# Altium project GN-1846-E-V2_HI3531A.PRJPCB (part 1 of 5)
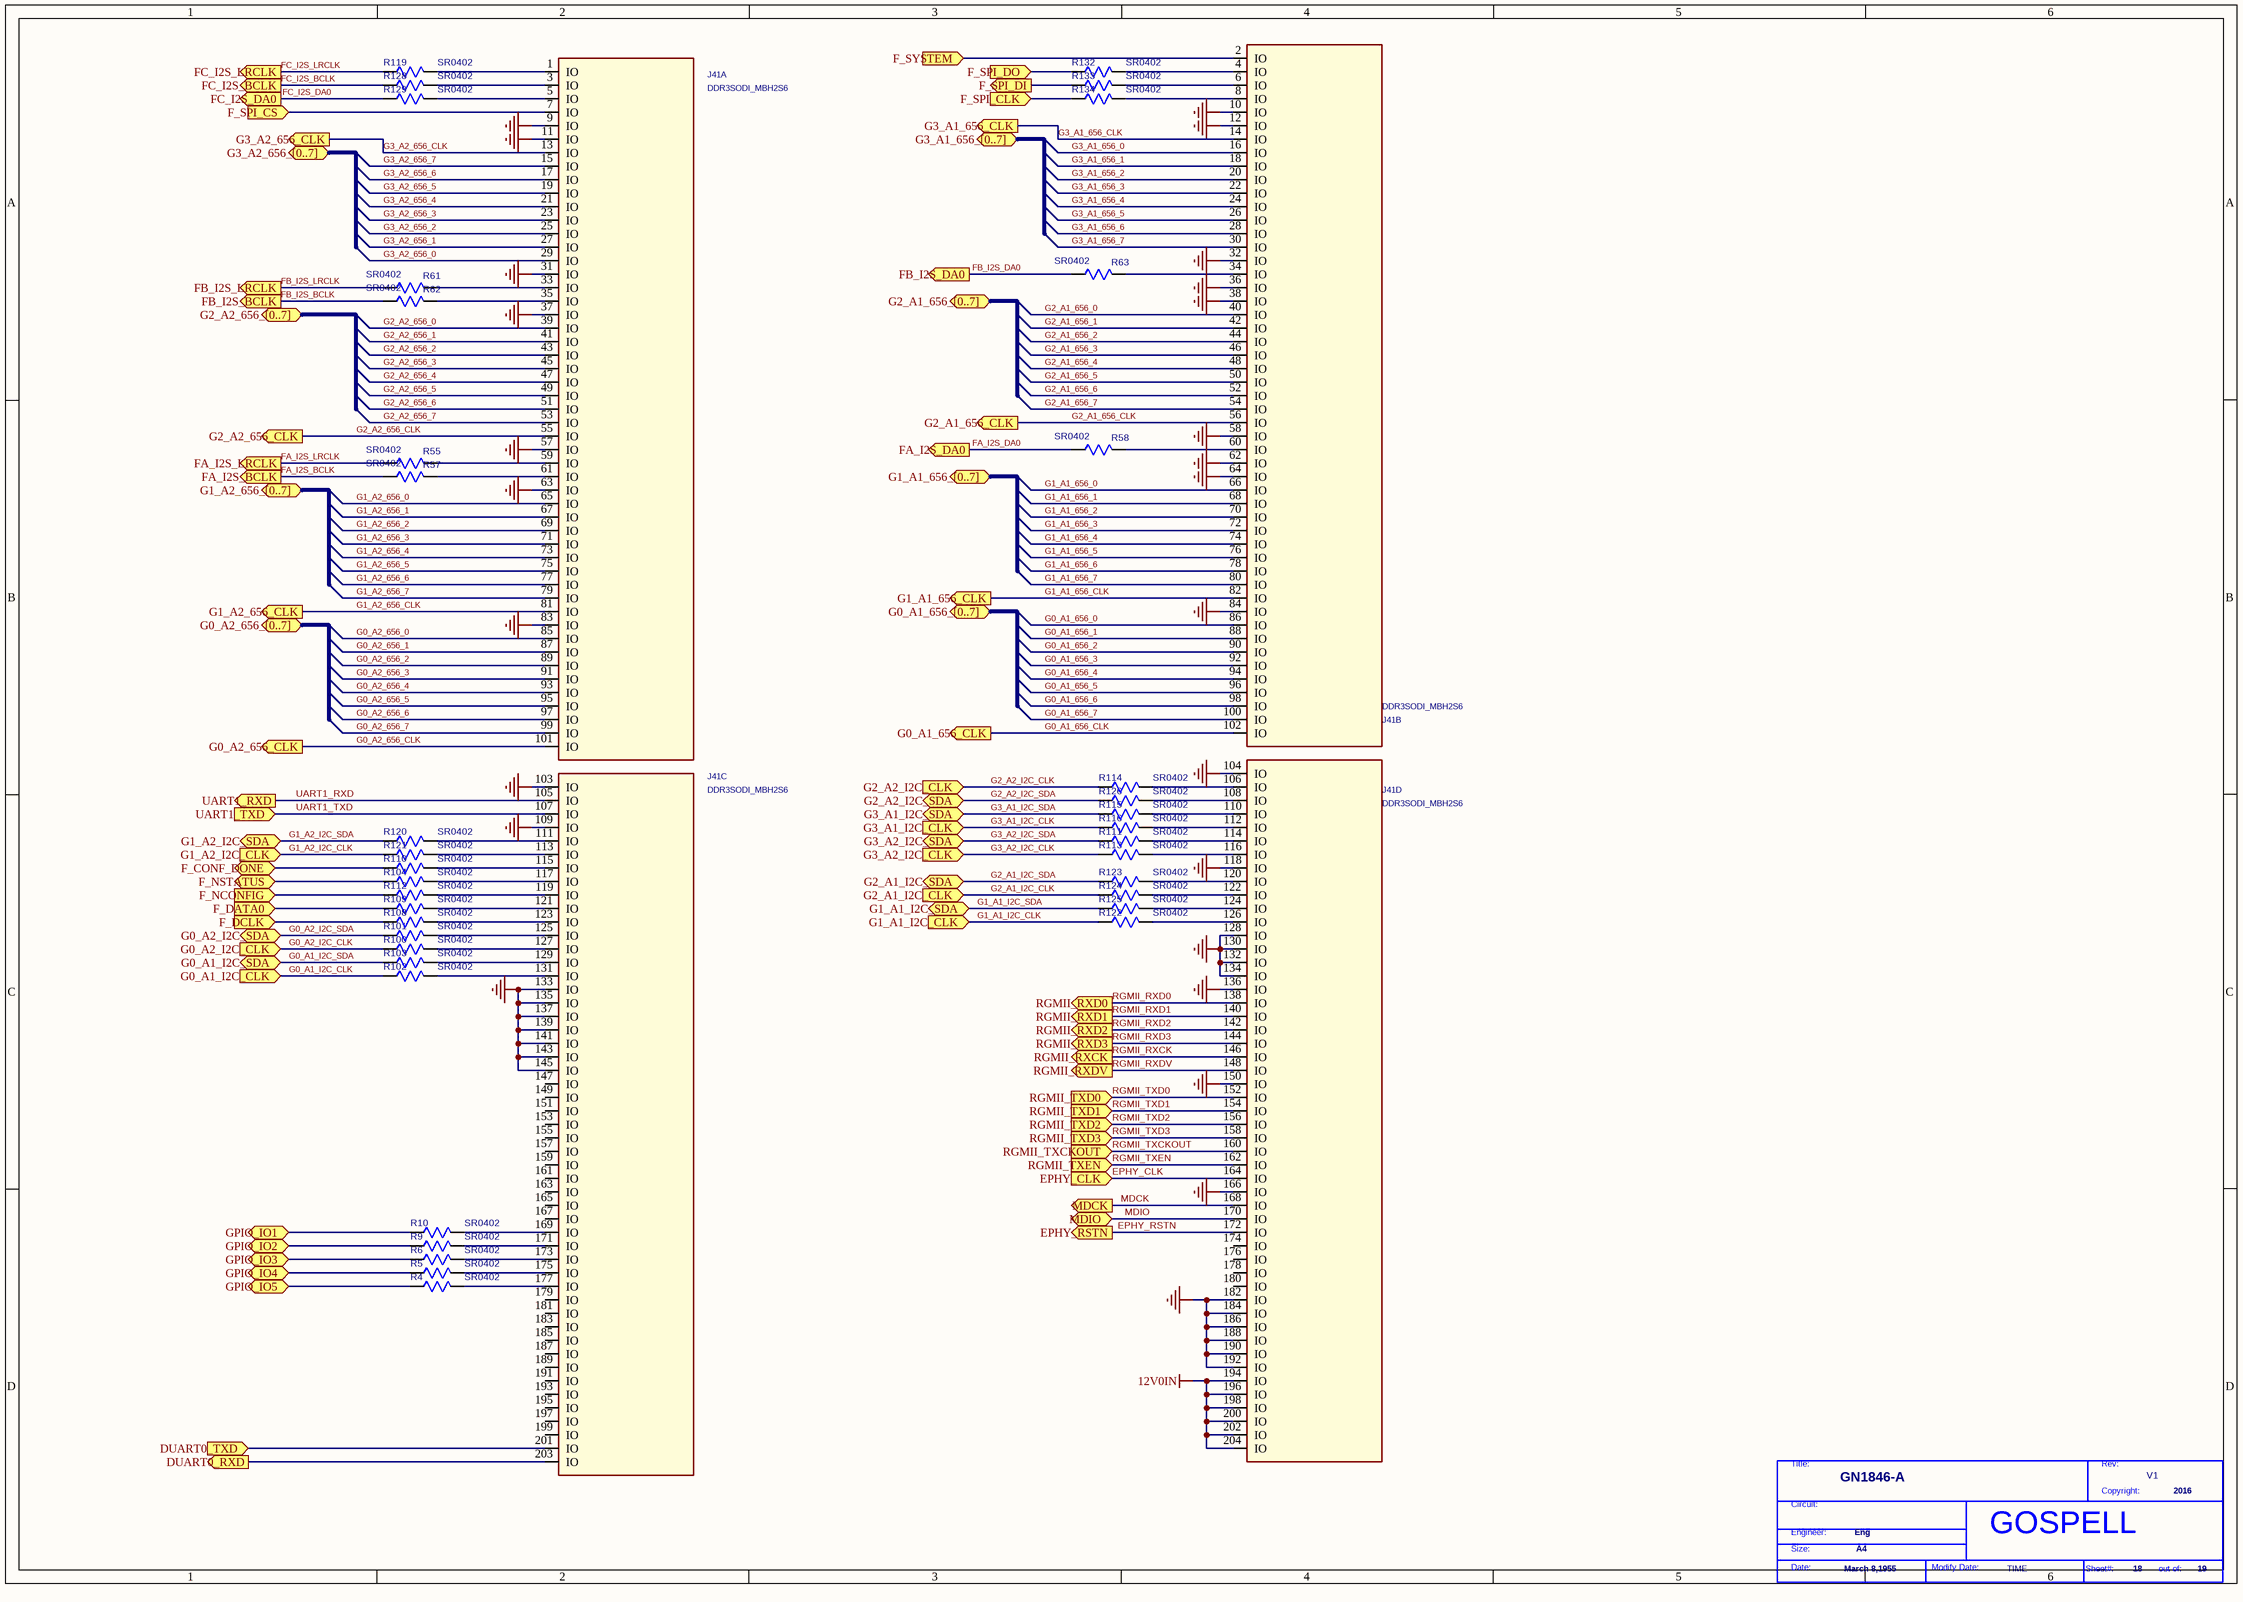
[diagram p0: P18 CONNECT DDR1.SchDoc]
18 sheets, 474 parts. Net scope: flat (ports and power ports of the same name join across sheets).
Board file: GN-1846-E-V2.PcbDoc
Sheets:
  P18 CONNECT DDR1.SchDoc
  P17 Hi3531AV100 (AD).SchDoc
  P16 Hi3531AV100(RGMII&I.SchDoc
  P15 Hi3531AV100(VO&I2S3.SchDoc
  P14 Hi3531AV100(SATA&PC.SchDoc
  P13 Configuration.SchDoc
  P12 SPI&NAND FLASH.SchDoc
  P11 Hi3531A(SYSTEM)&RES.SchDoc
  P10 DDRC&D NOVTT.SchDoc
  P09 DDRA&B NOVTT.SchDoc
  P08 Hi3531AV100(DDRC0 D.SchDoc
  P07 Hi3531AV100(POWER).SchDoc
  P06 Hi3531AV100(GND).SchDoc
  P05 Power Supply2.SchDoc
  P04 Power Supply1.SchDoc
  P03 POWER TREE.SchDoc
  P02 BLOCK DIAGRAM.SchDoc
  P01 NOTE $ TITLE.SchDoc

## Sheet P18 CONNECT DDR1.SchDoc
size 420 x 297 mm

### Parts
(Parts that share a designator on the sheet are numbered #1, #2 ... from top to bottom, then left to right.)
*#1  Page Modify Date: TIME  Engineer: Eng  Copyright: 2016  Title: GN1846-A  RevCode: V1  Page Size: A4  Page Create Date: March 8,1955  Page Number: 18  Page Count: 19  (hidden comment: GOSPELL)  (graphical)
J41  DDR3SODI_MBH2S6  [DDR3SODI_MBH2S6]  (parts A,B,C,D of 4)
R4  SR0402  [SR0402]
R5  SR0402  [SR0402]
R6  SR0402  [SR0402]
R9  SR0402  [SR0402]
R10  SR0402  [SR0402]
R55  SR0402  [SR0402]
R57  SR0402  [SR0402]
R58  SR0402  [SR0402]
R61  SR0402  [SR0402]
R62  SR0402  [SR0402]
R63  SR0402  [SR0402]
R100  SR0402  [SR0402]
R101  SR0402  [SR0402]
R102  SR0402  [SR0402]
R103  SR0402  [SR0402]
R104  SR0402  [SR0402]
R108  SR0402  [SR0402]
R109  SR0402  [SR0402]
R110  SR0402  [SR0402]
R111  SR0402  [SR0402]
R112  SR0402  [SR0402]
R113  SR0402  [SR0402]
R114  SR0402  [SR0402]
R115  SR0402  [SR0402]
R116  SR0402  [SR0402]
R119  SR0402  [SR0402]
R120  SR0402  [SR0402]
R121  SR0402  [SR0402]
R122  SR0402  [SR0402]
R123  SR0402  [SR0402]
R124  SR0402  [SR0402]
R125  SR0402  [SR0402]
R126  SR0402  [SR0402]
R128  SR0402  [SR0402]
R129  SR0402  [SR0402]
R132  SR0402  [SR0402]
R133  SR0402  [SR0402]
R134  SR0402  [SR0402]

### Ports
DUART0_RXD (out), DUART0_TXD (in), EPHY_CLK (in), EPHY_RSTN (out), F_CONF_DONE (bidir), F_DATA0 (in), F_DCLK (in), F_NCONFIG (in), F_NSTATUS (bidir), F_SPI_CLK (in), F_SPI_CS (in), F_SPI_DI (out), F_SPI_DO (in), F_SYSTEM (in), FA_I2S_BCLK (out), FA_I2S_DA0 (out), FA_I2S_LRCLK (out), FB_I2S_BCLK (out), FB_I2S_DA0 (out), FB_I2S_LRCLK (out), FC_I2S_BCLK (out), FC_I2S_DA0 (out), FC_I2S_LRCLK (out), G0_A1_656_[0..7] (bidir), G0_A1_656_CLK (out), G0_A1_I2C_CLK (in), G0_A1_I2C_SDA (bidir), G0_A2_656_[0..7] (bidir), G0_A2_656_CLK (out), G0_A2_I2C_CLK (in), G0_A2_I2C_SDA (bidir), G1_A1_656_[0..7] (bidir), G1_A1_656_CLK (out), G1_A1_I2C_CLK (in), G1_A1_I2C_SDA (bidir), G1_A2_656_[0..7] (bidir), G1_A2_656_CLK (out), G1_A2_I2C_CLK (in), G1_A2_I2C_SDA (bidir), G2_A1_656_[0..7] (bidir), G2_A1_656_CLK (out), G2_A1_I2C_CLK (in), G2_A1_I2C_SDA (bidir), G2_A2_656_[0..7] (bidir), G2_A2_656_CLK (out), G2_A2_I2C_CLK (in), G2_A2_I2C_SDA (bidir), G3_A1_656_[0..7] (bidir), G3_A1_656_CLK (out), G3_A1_I2C_CLK (in), G3_A1_I2C_SDA (bidir), G3_A2_656_[0..7] (bidir), G3_A2_656_CLK (out), G3_A2_I2C_CLK (in), G3_A2_I2C_SDA (bidir), GPIO_IO1 (bidir), GPIO_IO2 (bidir), GPIO_IO3 (bidir), GPIO_IO4 (bidir), GPIO_IO5 (bidir), MDCK (out), MDIO (bidir), RGMII_RXCK (out), RGMII_RXD0 (out), RGMII_RXD1 (out), RGMII_RXD2 (out), RGMII_RXD3 (out), RGMII_RXDV (out), RGMII_TXCKOUT (in), RGMII_TXD0 (in), RGMII_TXD1 (in), RGMII_TXD2 (in), RGMII_TXD3 (in), RGMII_TXEN (in), UART1_RXD (out), UART1_TXD (in)

### Nets
12V0IN: J41.194(IO) J41.196(IO) J41.198(IO) J41.200(IO) J41.202(IO) J41.204(IO)
GND: J41.9(IO) J41.10(IO) J41.11(IO) J41.12(IO) J41.31(IO) J41.32(IO) J41.36(IO) J41.37(IO) J41.38(IO) J41.57(IO) J41.58(IO) J41.62(IO) J41.63(IO) J41.64(IO) J41.83(IO) J41.84(IO) J41.103(IO) J41.104(IO) J41.109(IO) J41.118(IO) J41.128(IO) J41.130(IO) J41.132(IO) J41.133(IO) J41.134(IO) J41.135(IO) J41.136(IO) J41.137(IO) J41.139(IO) J41.141(IO) J41.143(IO) J41.145(IO) J41.150(IO) J41.166(IO) J41.182(IO) J41.184(IO) J41.186(IO) J41.188(IO) J41.190(IO) J41.192(IO)
EPHY_CLK: J41.164(IO) ; port EPHY_CLK
EPHY_RSTN: J41.172(IO) ; port EPHY_RSTN
F_SPI_CLK: R134.1(A) ; port F_SPI_CLK
F_SPI_CS: J41.7(IO) ; port F_SPI_CS
F_SPI_DI: R133.1(A) ; port F_SPI_DI
F_SPI_DO: R132.1(A) ; port F_SPI_DO
FA_I2S_BCLK: R57.2(B) ; port FA_I2S_BCLK
FA_I2S_DA0: R58.2(B) ; port FA_I2S_DA0
FA_I2S_LRCLK: R55.2(B) ; port FA_I2S_LRCLK
FB_I2S_BCLK: R62.2(B) ; port FB_I2S_BCLK
FB_I2S_DA0: R63.2(B) ; port FB_I2S_DA0
FB_I2S_LRCLK: R61.2(B) ; port FB_I2S_LRCLK
FC_I2S_BCLK: R128.1(A) ; port FC_I2S_BCLK
FC_I2S_DA0: R129.1(A) ; port FC_I2S_DA0
FC_I2S_LRCLK: R119.1(A) ; port FC_I2S_LRCLK
G0_A1_656_0: J41.86(IO)
G0_A1_656_1: J41.88(IO)
G0_A1_656_2: J41.90(IO)
G0_A1_656_3: J41.92(IO)
G0_A1_656_4: J41.94(IO)
G0_A1_656_5: J41.96(IO)
G0_A1_656_6: J41.98(IO)
G0_A1_656_7: J41.100(IO)
G0_A1_656_CLK: J41.102(IO) ; port G0_A1_656_CLK
G0_A1_I2C_CLK: R102.1(A) ; port G0_A1_I2C_CLK
G0_A1_I2C_SDA: R103.1(A) ; port G0_A1_I2C_SDA
G0_A2_656_0: J41.85(IO)
G0_A2_656_1: J41.87(IO)
G0_A2_656_2: J41.89(IO)
G0_A2_656_3: J41.91(IO)
G0_A2_656_4: J41.93(IO)
G0_A2_656_5: J41.95(IO)
G0_A2_656_6: J41.97(IO)
G0_A2_656_7: J41.99(IO)
G0_A2_656_CLK: J41.101(IO) ; port G0_A2_656_CLK
G0_A2_I2C_CLK: R100.1(A) ; port G0_A2_I2C_CLK
G0_A2_I2C_SDA: R101.1(A) ; port G0_A2_I2C_SDA
G1_A1_656_0: J41.66(IO)
G1_A1_656_1: J41.68(IO)
G1_A1_656_2: J41.70(IO)
G1_A1_656_3: J41.72(IO)
G1_A1_656_4: J41.74(IO)
G1_A1_656_5: J41.76(IO)
G1_A1_656_6: J41.78(IO)
G1_A1_656_7: J41.80(IO)
G1_A1_656_CLK: J41.82(IO) ; port G1_A1_656_CLK
G1_A1_I2C_CLK: R122.1(A) ; port G1_A1_I2C_CLK
G1_A1_I2C_SDA: R125.1(A) ; port G1_A1_I2C_SDA
G1_A2_656_0: J41.65(IO)
G1_A2_656_1: J41.67(IO)
G1_A2_656_2: J41.69(IO)
G1_A2_656_3: J41.71(IO)
G1_A2_656_4: J41.73(IO)
G1_A2_656_5: J41.75(IO)
G1_A2_656_6: J41.77(IO)
G1_A2_656_7: J41.79(IO)
G1_A2_656_CLK: J41.81(IO) ; port G1_A2_656_CLK
G1_A2_I2C_CLK: R121.1(A) ; port G1_A2_I2C_CLK
G1_A2_I2C_SDA: R120.1(A) ; port G1_A2_I2C_SDA
G2_A1_656_0: J41.40(IO)
G2_A1_656_1: J41.42(IO)
G2_A1_656_2: J41.44(IO)
G2_A1_656_3: J41.46(IO)
G2_A1_656_4: J41.48(IO)
G2_A1_656_5: J41.50(IO)
G2_A1_656_6: J41.52(IO)
G2_A1_656_7: J41.54(IO)
G2_A1_656_CLK: J41.56(IO) ; port G2_A1_656_CLK
G2_A1_I2C_CLK: R124.1(A) ; port G2_A1_I2C_CLK
G2_A1_I2C_SDA: R123.1(A) ; port G2_A1_I2C_SDA
G2_A2_656_0: J41.39(IO)
G2_A2_656_1: J41.41(IO)
G2_A2_656_2: J41.43(IO)
G2_A2_656_3: J41.45(IO)
G2_A2_656_4: J41.47(IO)
G2_A2_656_5: J41.49(IO)
G2_A2_656_6: J41.51(IO)
G2_A2_656_7: J41.53(IO)
G2_A2_656_CLK: J41.55(IO) ; port G2_A2_656_CLK
G2_A2_I2C_CLK: R114.1(A) ; port G2_A2_I2C_CLK
G2_A2_I2C_SDA: R126.1(A) ; port G2_A2_I2C_SDA
G3_A1_656_0: J41.16(IO)
G3_A1_656_1: J41.18(IO)
G3_A1_656_2: J41.20(IO)
G3_A1_656_3: J41.22(IO)
G3_A1_656_4: J41.24(IO)
G3_A1_656_5: J41.26(IO)
G3_A1_656_6: J41.28(IO)
G3_A1_656_7: J41.30(IO)
G3_A1_656_CLK: J41.14(IO) ; port G3_A1_656_CLK
G3_A1_I2C_CLK: R116.1(A) ; port G3_A1_I2C_CLK
G3_A1_I2C_SDA: R115.1(A) ; port G3_A1_I2C_SDA
G3_A2_656_0: J41.29(IO)
G3_A2_656_1: J41.27(IO)
G3_A2_656_2: J41.25(IO)
G3_A2_656_3: J41.23(IO)
G3_A2_656_4: J41.21(IO)
G3_A2_656_5: J41.19(IO)
G3_A2_656_6: J41.17(IO)
G3_A2_656_7: J41.15(IO)
G3_A2_656_CLK: J41.13(IO) ; port G3_A2_656_CLK
G3_A2_I2C_CLK: R113.1(A) ; port G3_A2_I2C_CLK
G3_A2_I2C_SDA: R111.1(A) ; port G3_A2_I2C_SDA
MDCK: J41.168(IO) ; port MDCK
MDIO: J41.170(IO) ; port MDIO
RGMII_RXCK: J41.146(IO) ; port RGMII_RXCK
RGMII_RXD0: J41.138(IO) ; port RGMII_RXD0
RGMII_RXD1: J41.140(IO) ; port RGMII_RXD1
RGMII_RXD2: J41.142(IO) ; port RGMII_RXD2
RGMII_RXD3: J41.144(IO) ; port RGMII_RXD3
RGMII_RXDV: J41.148(IO) ; port RGMII_RXDV
RGMII_TXCKOUT: J41.160(IO) ; port RGMII_TXCKOUT
RGMII_TXD0: J41.152(IO) ; port RGMII_TXD0
RGMII_TXD1: J41.154(IO) ; port RGMII_TXD1
RGMII_TXD2: J41.156(IO) ; port RGMII_TXD2
RGMII_TXD3: J41.158(IO) ; port RGMII_TXD3
RGMII_TXEN: J41.162(IO) ; port RGMII_TXEN
UART1_RXD: J41.105(IO) ; port UART1_RXD
UART1_TXD: J41.107(IO) ; port UART1_TXD
NetC1_1: J41.201(IO) ; port DUART0_TXD
NetC2_1: J41.203(IO) ; port DUART0_RXD
NetJ41_1: J41.1(IO) R119.2(B)
NetJ41_2: J41.2(IO) ; port F_SYSTEM
NetJ41_3: J41.3(IO) R128.2(B)
NetJ41_4: J41.4(IO) R132.2(B)
NetJ41_5: J41.5(IO) R129.2(B)
NetJ41_6: J41.6(IO) R133.2(B)
NetJ41_8: J41.8(IO) R134.2(B)
NetJ41_33: J41.33(IO) R61.1(A)
NetJ41_34: J41.34(IO) R63.1(A)
NetJ41_35: J41.35(IO) R62.1(A)
NetJ41_59: J41.59(IO) R55.1(A)
NetJ41_60: J41.60(IO) R58.1(A)
NetJ41_61: J41.61(IO) R57.1(A)
NetJ41_106: J41.106(IO) R114.2(B)
NetJ41_108: J41.108(IO) R126.2(B)
NetJ41_110: J41.110(IO) R115.2(B)
NetJ41_111: J41.111(IO) R120.2(B)
NetJ41_112: J41.112(IO) R116.2(B)
NetJ41_113: J41.113(IO) R121.2(B)
NetJ41_114: J41.114(IO) R111.2(B)
NetJ41_115: J41.115(IO) R110.2(B)
NetJ41_116: J41.116(IO) R113.2(B)
NetJ41_117: J41.117(IO) R104.2(B)
NetJ41_119: J41.119(IO) R112.2(B)
NetJ41_120: J41.120(IO) R123.2(B)
NetJ41_121: J41.121(IO) R109.2(B)
NetJ41_122: J41.122(IO) R124.2(B)
NetJ41_123: J41.123(IO) R108.2(B)
NetJ41_124: J41.124(IO) R125.2(B)
NetJ41_125: J41.125(IO) R101.2(B)
NetJ41_126: J41.126(IO) R122.2(B)
NetJ41_127: J41.127(IO) R100.2(B)
NetJ41_129: J41.129(IO) R103.2(B)
NetJ41_131: J41.131(IO) R102.2(B)
NetJ41_169: J41.169(IO) R10.2(B)
NetJ41_171: J41.171(IO) R9.2(B)
NetJ41_173: J41.173(IO) R6.2(B)
NetJ41_175: J41.175(IO) R5.2(B)
NetJ41_177: J41.177(IO) R4.2(B)
NetR4_1: R4.1(A) ; port GPIO_IO5
NetR5_1: R5.1(A) ; port GPIO_IO4
NetR6_1: R6.1(A) ; port GPIO_IO3
NetR9_1: R9.1(A) ; port GPIO_IO2
NetR10_1: R10.1(A) ; port GPIO_IO1
NetR104_1: R104.1(A) ; port F_NSTATUS
NetR108_1: R108.1(A) ; port F_DCLK
NetR109_1: R109.1(A) ; port F_DATA0
NetR110_1: R110.1(A) ; port F_CONF_DONE
NetR112_1: R112.1(A) ; port F_NCONFIG

Not connected (* = marked no-connect by the designer): J41 147(IO) 149(IO) 151(IO) 153(IO) 155(IO) 157(IO) 159(IO) 161(IO) 163(IO) 165(IO) 167(IO) 174(IO) 176(IO) 178(IO) 179(IO) 180(IO) 181(IO) 183(IO) 185(IO) 187(IO) 189(IO) 191(IO) 193(IO) 195(IO) 197(IO) 199(IO)

### Notes on the sheet
- (in symbol GOSPELL) Title:; Rev:; Copyright:; Circuit:; Engineer:; Size:; Date:; Modify Date:; Sheet#:; out of:

### Library data of the parts
*#1 = GOSPELL: Cage Code: 2017
J41 = DDRSD_MB: SWAP_INFO: (S1+S2+S3+S4); SPLIT_INST: TRUE
R4-R6 R9 R10 R108 R109 R112 R119-R121 R128 R129 = R_1: PARTS: 1; LEVEL: STD; DEVICE: RC0402FR_0733RL; PINSWAP: (A,B); OriginalSymbolOrigin: (10,20); %208%%161%%192%%224%%195%%251%%179%%198%: 片式厚膜电阻器; COMPONENT_HIGH_MAX: 0.4MM; %215%%232%%214%%181%%212%%202%%208%%237%%198%%171%%178%%238%: +/-1%; %182%%238%%182%%168%%185%%166%%194%%202%(W): 0.06; %195%%232%%202%%246%: 片式厚膜电阻器-0.0625W-33OHM-+/-1%-0402; CODE: 7090836; PKG_TYPE: SR0402
R55 R57 R58 R61-R63 = R_1: PARTS: 1; LEVEL: STD; DEVICE: RK73B1ELTP472J; PINSWAP: (A,B); OriginalSymbolOrigin: (10,20); %208%%161%%192%%224%%195%%251%%179%%198%: 片式厚膜电阻器; COMPONENT_HIGH_MAX: 0.4MM; %215%%232%%214%%181%%212%%202%%208%%237%%198%%171%%178%%238%: +/-5%; %182%%238%%182%%168%%185%%166%%194%%202%(W): 0.06; %195%%232%%202%%246%: 片式厚膜电阻器-0.0625W-4700OHM-+/-5%-0402-BT; CODE: 7090793; PKG_TYPE: SR0402
R100-R104 R110 R111 R113-R116 R122-R126 R132-R134 = R_1: PARTS: 1; LEVEL: STD; DEVICE: RC0402FR_0733RL; PINSWAP: (A,B); OriginalSymbolOrigin: (10,20); CODE: 7090836; %195%%232%%202%%246%: 片式厚膜电阻器-0.0625W-33OHM-+/-1%-0402; %182%%238%%182%%168%%185%%166%%194%%202%(W): 0.06; %215%%232%%214%%181%%212%%202%%208%%237%%198%%171%%178%%238%: +/-1%; COMPONENT_HIGH_MAX: 0.4MM; %208%%161%%192%%224%%195%%251%%179%%198%: 片式厚膜电阻器; PKG_TYPE: SR0402

## Sheet P17 Hi3531AV100 (AD).SchDoc
size 420 x 297 mm
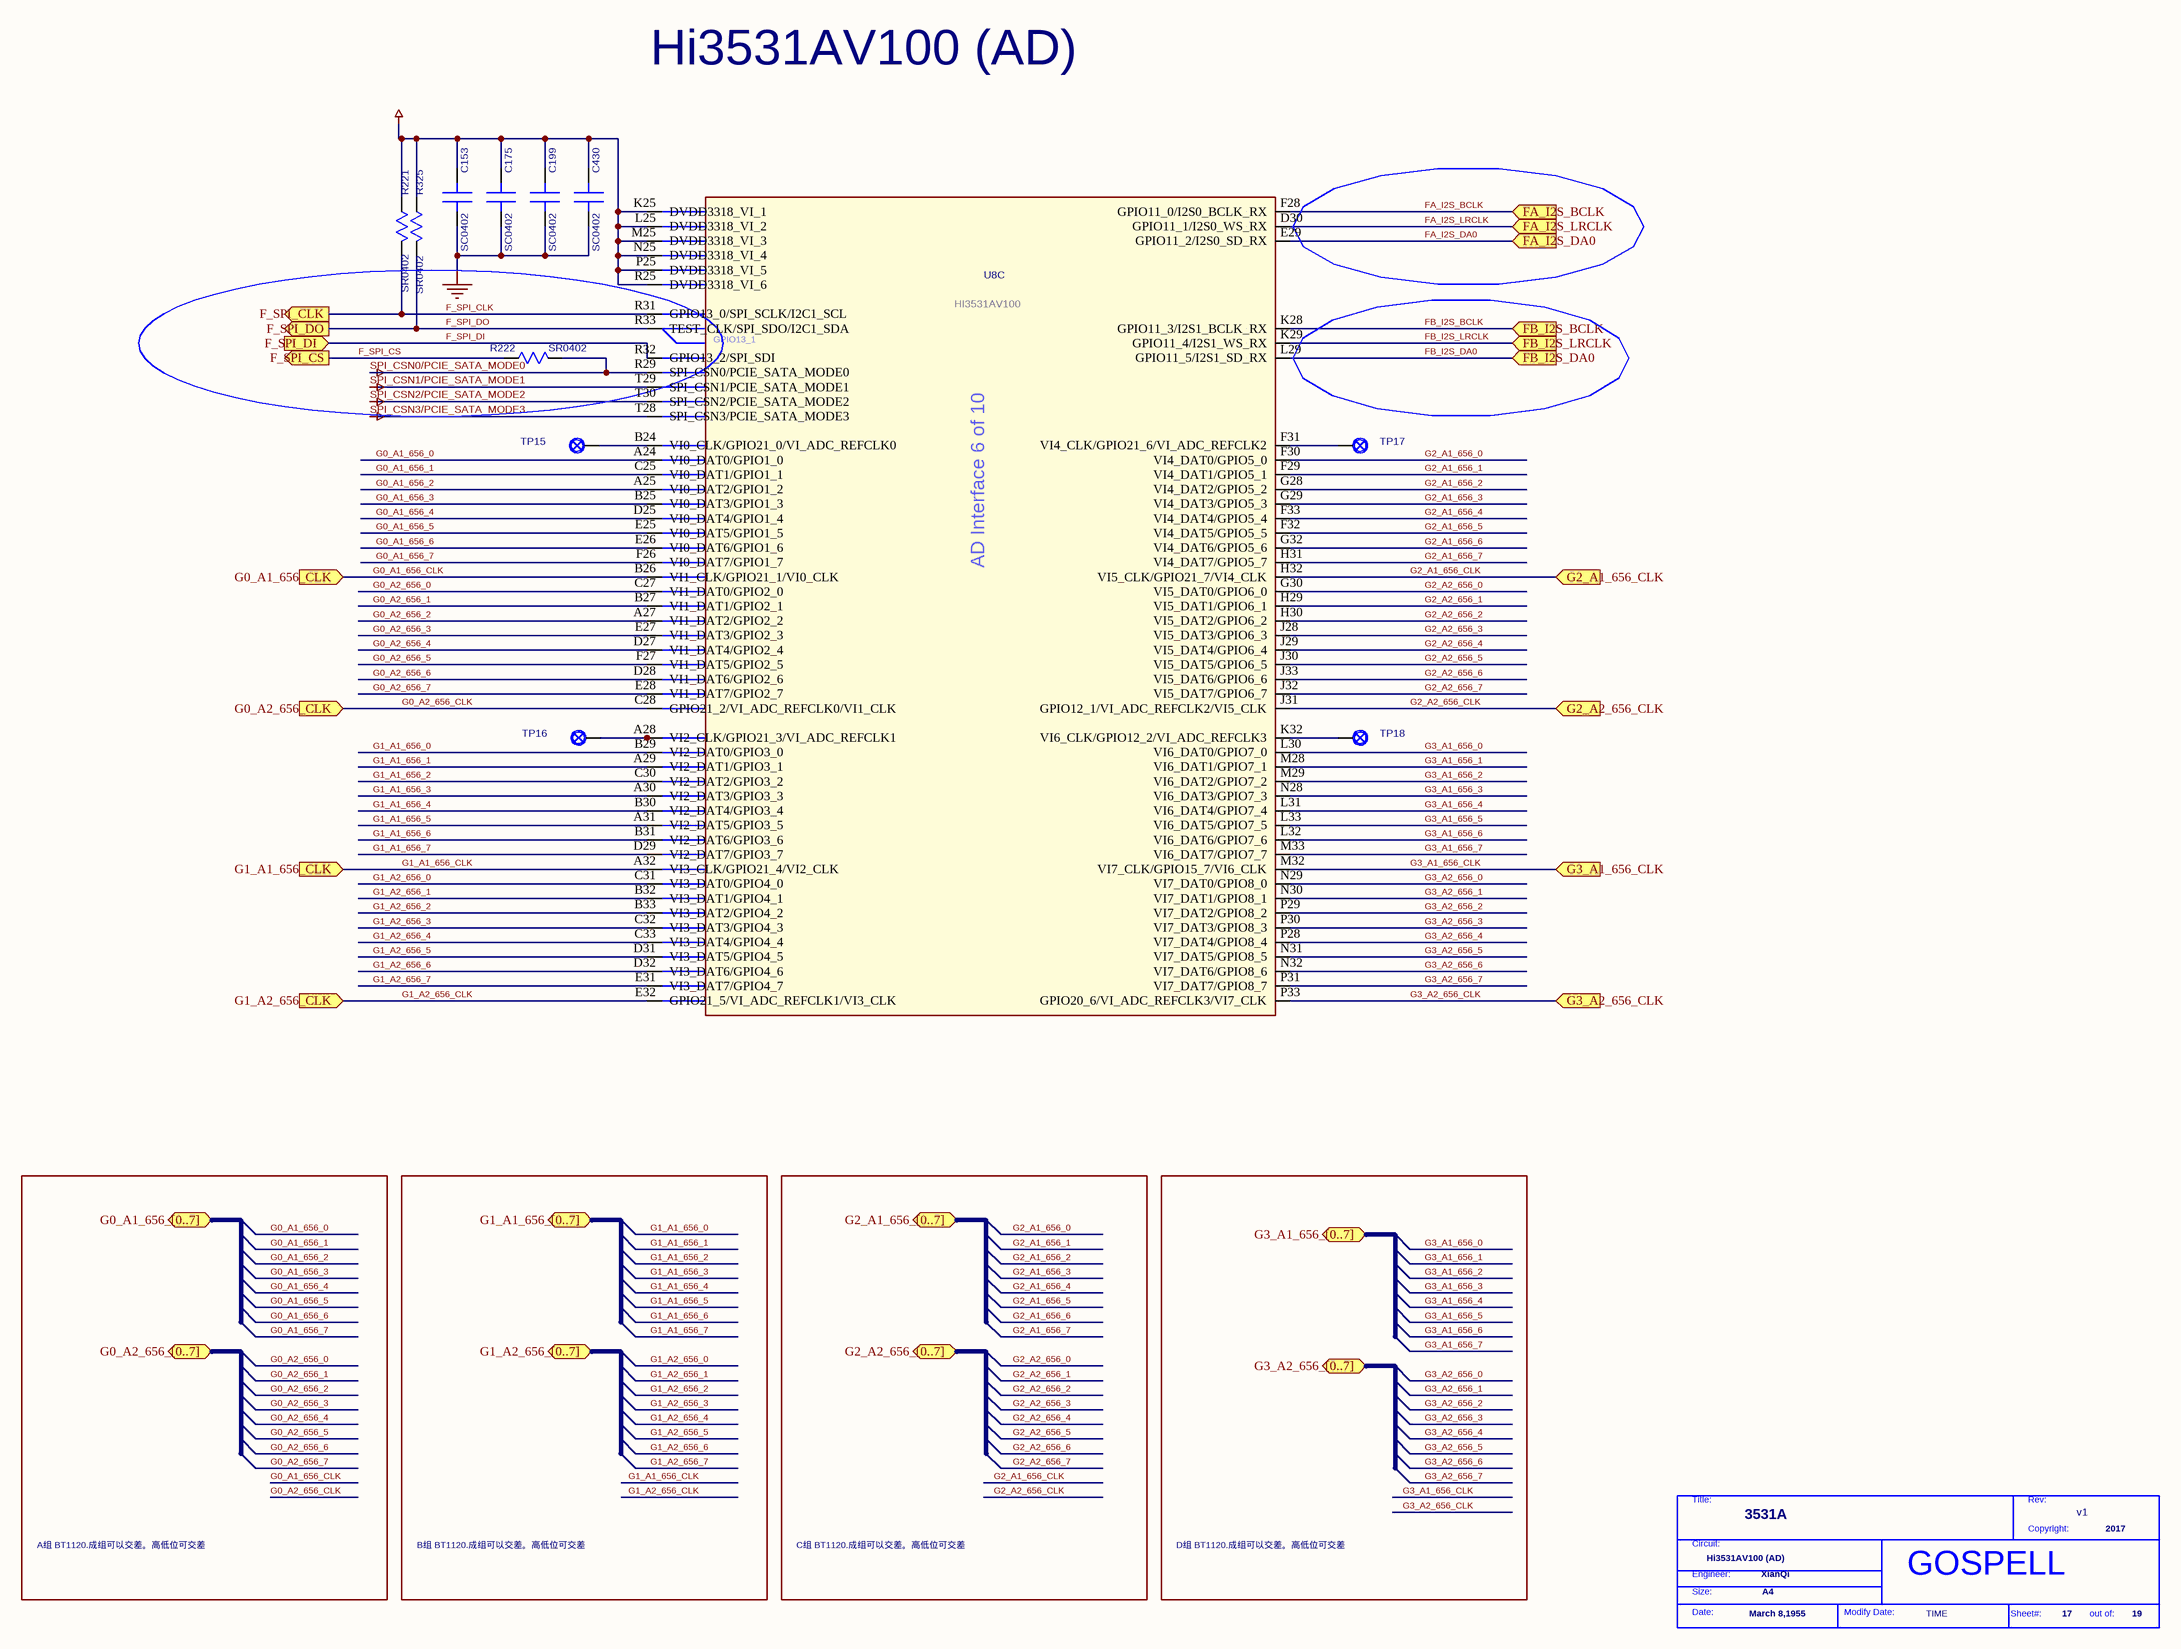
[diagram p1: P17 Hi3531AV100 (AD).SchDoc]

### Parts
(Parts that share a designator on the sheet are numbered #1, #2 ... from top to bottom, then left to right.)
*#2  Page Modify Date: TIME  Engineer: XianQi  Copyright: 2017  Title: 3531A  RevCode: v1  Page Size: A4  Page Create Date: March 8,1955  Page Number: 17  Page Count: 19  Doc: Hi3531AV100 (AD)  (hidden comment: GOSPELL)  (graphical)
C153  SC0402  [SC0402]
C175  SC0402  [SC0402]
C199  SC0402  [SC0402]
C430  SC0402  [SC0402]
R221  SR0402  [SR0402]
R222  SR0402  [SR0402]
R325  SR0402  [SR0402]
TP15  TP24-SMD  [TP24-SMD]  (value not drawn)
TP16  TP24-SMD  [TP24-SMD]  (value not drawn)
TP17  TP24-SMD  [TP24-SMD]  (value not drawn)
TP18  TP24-SMD  [TP24-SMD]  (value not drawn)
U8  DEVICE: HI3531AV100  [BGA805-32-3333]  (hidden comment: BGA805-32-3333)  (part C of 10)

### Ports
F_SPI_CLK (out), F_SPI_CS (out), F_SPI_DI (in), F_SPI_DO (out), FA_I2S_BCLK (in), FA_I2S_DA0 (in), FA_I2S_LRCLK (in), FB_I2S_BCLK (in), FB_I2S_DA0 (in), FB_I2S_LRCLK (in), G0_A1_656_[0..7] (bidir), G0_A1_656_CLK (in), G0_A2_656_[0..7] (bidir), G0_A2_656_CLK (in), G1_A1_656_[0..7] (bidir), G1_A1_656_CLK (in), G1_A2_656_[0..7] (bidir), G1_A2_656_CLK (in), G2_A1_656_[0..7] (bidir), G2_A1_656_CLK (in), G2_A2_656_[0..7] (bidir), G2_A2_656_CLK (in), G3_A1_656_[0..7] (bidir), G3_A1_656_CLK (in), G3_A2_656_[0..7] (bidir), G3_A2_656_CLK (in)

### Nets
3V3: C153.1(A) C175.1(A) C199.1(A) C430.1(A) R221.1(A) R325.1(A) U8.K25(DVDD3318_VI_1) U8.L25(DVDD3318_VI_2) U8.M25(DVDD3318_VI_3) U8.N25(DVDD3318_VI_4) U8.P25(DVDD3318_VI_5) U8.R25(DVDD3318_VI_6)
GND: C153.2(B) C175.2(B) C199.2(B) C430.2(B)
SPI_CSN0/PCIE_SATA_MODE0: R222.2(B) U8.R29(SPI_CSN0/PCIE_SATA_MODE0)
SPI_CSN1/PCIE_SATA_MODE1: U8.T29(SPI_CSN1/PCIE_SATA_MODE1)
SPI_CSN2/PCIE_SATA_MODE2: U8.T30(SPI_CSN2/PCIE_SATA_MODE2)
SPI_CSN3/PCIE_SATA_MODE3: U8.T28(SPI_CSN3/PCIE_SATA_MODE3)
F_SPI_CLK: R221.2(B) U8.R31(GPIO13_0/SPI_SCLK/I2C1_SCL) ; port F_SPI_CLK
F_SPI_CS: R222.1(A) ; port F_SPI_CS
F_SPI_DI: U8.R32(GPIO13_2/SPI_SDI) ; port F_SPI_DI
F_SPI_DO: R325.2(B) U8.R33(TEST_CLK/SPI_SDO/I2C1_SDA) ; port F_SPI_DO
FA_I2S_BCLK: U8.F28(GPIO11_0/I2S0_BCLK_RX) ; port FA_I2S_BCLK
FA_I2S_DA0: U8.E29(GPIO11_2/I2S0_SD_RX) ; port FA_I2S_DA0
FA_I2S_LRCLK: U8.D30(GPIO11_1/I2S0_WS_RX) ; port FA_I2S_LRCLK
FB_I2S_BCLK: U8.K28(GPIO11_3/I2S1_BCLK_RX) ; port FB_I2S_BCLK
FB_I2S_DA0: U8.L29(GPIO11_5/I2S1_SD_RX) ; port FB_I2S_DA0
FB_I2S_LRCLK: U8.K29(GPIO11_4/I2S1_WS_RX) ; port FB_I2S_LRCLK
G0_A1_656_0: U8.A24(VI0_DAT0/GPIO1_0)
G0_A1_656_1: U8.C25(VI0_DAT1/GPIO1_1)
G0_A1_656_2: U8.A25(VI0_DAT2/GPIO1_2)
G0_A1_656_3: U8.B25(VI0_DAT3/GPIO1_3)
G0_A1_656_4: U8.D25(VI0_DAT4/GPIO1_4)
G0_A1_656_5: U8.E25(VI0_DAT5/GPIO1_5)
G0_A1_656_6: U8.E26(VI0_DAT6/GPIO1_6)
G0_A1_656_7: U8.F26(VI0_DAT7/GPIO1_7)
G0_A1_656_CLK: U8.B26(VI1_CLK/GPIO21_1/VI0_CLK) ; port G0_A1_656_CLK
G0_A2_656_0: U8.C27(VI1_DAT0/GPIO2_0)
G0_A2_656_1: U8.B27(VI1_DAT1/GPIO2_1)
G0_A2_656_2: U8.A27(VI1_DAT2/GPIO2_2)
G0_A2_656_3: U8.E27(VI1_DAT3/GPIO2_3)
G0_A2_656_4: U8.D27(VI1_DAT4/GPIO2_4)
G0_A2_656_5: U8.F27(VI1_DAT5/GPIO2_5)
G0_A2_656_6: U8.D28(VI1_DAT6/GPIO2_6)
G0_A2_656_7: U8.E28(VI1_DAT7/GPIO2_7)
G0_A2_656_CLK: U8.C28(GPIO21_2/VI_ADC_REFCLK0/VI1_CLK) ; port G0_A2_656_CLK
G1_A1_656_0: U8.B29(VI2_DAT0/GPIO3_0)
G1_A1_656_1: U8.A29(VI2_DAT1/GPIO3_1)
G1_A1_656_2: U8.C30(VI2_DAT2/GPIO3_2)
G1_A1_656_3: U8.A30(VI2_DAT3/GPIO3_3)
G1_A1_656_4: U8.B30(VI2_DAT4/GPIO3_4)
G1_A1_656_5: U8.A31(VI2_DAT5/GPIO3_5)
G1_A1_656_6: U8.B31(VI2_DAT6/GPIO3_6)
G1_A1_656_7: U8.D29(VI2_DAT7/GPIO3_7)
G1_A1_656_CLK: U8.A32(VI3_CLK/GPIO21_4/VI2_CLK) ; port G1_A1_656_CLK
G1_A2_656_0: U8.C31(VI3_DAT0/GPIO4_0)
G1_A2_656_1: U8.B32(VI3_DAT1/GPIO4_1)
G1_A2_656_2: U8.B33(VI3_DAT2/GPIO4_2)
G1_A2_656_3: U8.C32(VI3_DAT3/GPIO4_3)
G1_A2_656_4: U8.C33(VI3_DAT4/GPIO4_4)
G1_A2_656_5: U8.D31(VI3_DAT5/GPIO4_5)
G1_A2_656_6: U8.D32(VI3_DAT6/GPIO4_6)
G1_A2_656_7: U8.E31(VI3_DAT7/GPIO4_7)
G1_A2_656_CLK: U8.E32(GPIO21_5/VI_ADC_REFCLK1/VI3_CLK) ; port G1_A2_656_CLK
G2_A1_656_0: U8.F30(VI4_DAT0/GPIO5_0)
G2_A1_656_1: U8.F29(VI4_DAT1/GPIO5_1)
G2_A1_656_2: U8.G28(VI4_DAT2/GPIO5_2)
G2_A1_656_3: U8.G29(VI4_DAT3/GPIO5_3)
G2_A1_656_4: U8.F33(VI4_DAT4/GPIO5_4)
G2_A1_656_5: U8.F32(VI4_DAT5/GPIO5_5)
G2_A1_656_6: U8.G32(VI4_DAT6/GPIO5_6)
G2_A1_656_7: U8.H31(VI4_DAT7/GPIO5_7)
G2_A1_656_CLK: U8.H32(VI5_CLK/GPIO21_7/VI4_CLK) ; port G2_A1_656_CLK
G2_A2_656_0: U8.G30(VI5_DAT0/GPIO6_0)
G2_A2_656_1: U8.H29(VI5_DAT1/GPIO6_1)
G2_A2_656_2: U8.H30(VI5_DAT2/GPIO6_2)
G2_A2_656_3: U8.J28(VI5_DAT3/GPIO6_3)
G2_A2_656_4: U8.J29(VI5_DAT4/GPIO6_4)
G2_A2_656_5: U8.J30(VI5_DAT5/GPIO6_5)
G2_A2_656_6: U8.J33(VI5_DAT6/GPIO6_6)
G2_A2_656_7: U8.J32(VI5_DAT7/GPIO6_7)
G2_A2_656_CLK: U8.J31(GPIO12_1/VI_ADC_REFCLK2/VI5_CLK) ; port G2_A2_656_CLK
G3_A1_656_0: U8.L30(VI6_DAT0/GPIO7_0)
G3_A1_656_1: U8.M28(VI6_DAT1/GPIO7_1)
G3_A1_656_2: U8.M29(VI6_DAT2/GPIO7_2)
G3_A1_656_3: U8.N28(VI6_DAT3/GPIO7_3)
G3_A1_656_4: U8.L31(VI6_DAT4/GPIO7_4)
G3_A1_656_5: U8.L33(VI6_DAT5/GPIO7_5)
G3_A1_656_6: U8.L32(VI6_DAT6/GPIO7_6)
G3_A1_656_7: U8.M33(VI6_DAT7/GPIO7_7)
G3_A1_656_CLK: U8.M32(VI7_CLK/GPIO15_7/VI6_CLK) ; port G3_A1_656_CLK
G3_A2_656_0: U8.N29(VI7_DAT0/GPIO8_0)
G3_A2_656_1: U8.N30(VI7_DAT1/GPIO8_1)
G3_A2_656_2: U8.P29(VI7_DAT2/GPIO8_2)
G3_A2_656_3: U8.P30(VI7_DAT3/GPIO8_3)
G3_A2_656_4: U8.P28(VI7_DAT4/GPIO8_4)
G3_A2_656_5: U8.N31(VI7_DAT5/GPIO8_5)
G3_A2_656_6: U8.N32(VI7_DAT6/GPIO8_6)
G3_A2_656_7: U8.P31(VI7_DAT7/GPIO8_7)
G3_A2_656_CLK: U8.P33(GPIO20_6/VI_ADC_REFCLK3/VI7_CLK) ; port G3_A2_656_CLK
NetTP15_1: TP15.1 U8.B24(VI0_CLK/GPIO21_0/VI_ADC_REFCLK0)
NetTP16_1: TP16.1 U8.A28(VI2_CLK/GPIO21_3/VI_ADC_REFCLK1)
NetTP17_1: TP17.1 U8.F31(VI4_CLK/GPIO21_6/VI_ADC_REFCLK2)
NetTP18_1: TP18.1 U8.K32(VI6_CLK/GPIO12_2/VI_ADC_REFCLK3)

### Notes on the sheet
- Hi3531AV100 (AD)
- A组 BT1120.成组可以交差。高低位可交差
- B组 BT1120.成组可以交差。高低位可交差
- C组 BT1120.成组可以交差。高低位可交差
- D组 BT1120.成组可以交差。高低位可交差
- (in symbol GOSPELL) Title:; Rev:; Copyright:; Circuit:; Engineer:; Size:; Date:; Modify Date:; Sheet#:; out of:
- (in symbol HI3531AV100_M2_17, part C) GPIO13_1; AD Interface 6 of 10

### Library data of the parts
C153 = C_0_Dup2: PARTS: 1; PINSWAP: (A,B); LEVEL: STD; DEVICE: RMEMK105BJ104KV_FR; OriginalSymbolOrigin: (0,30); %208%%161%%192%%224%%195%%251%%179%%198%: SMD陶瓷电容; COMPONENT_HIGH_MAX: 0.6MM; %182%%238%%182%%168%%185%%164%%215%%247%%181%%231%%209%%185%(V): 16; %195%%232%%202%%246%: SMD陶瓷电容-16V-100NF-+/-10%-X7R-0402-BT; CODE: 8070614; PKG_TYPE: SC0402
C175 = C_0_Dup2: PARTS: 1; PINSWAP: (A,B); LEVEL: STD; DEVICE: RMEMK105BJ104KV_FR; OriginalSymbolOrigin: (0,30); CODE: 8070614; %195%%232%%202%%246%: SMD陶瓷电容-16V-100NF-+/-10%-X7R-0402-BT; %182%%238%%182%%168%%185%%164%%215%%247%%181%%231%%209%%185%(V): 16; COMPONENT_HIGH_MAX: 0.6MM; %208%%161%%192%%224%%195%%251%%179%%198%: SMD陶瓷电容; PKG_TYPE: SC0402
C199 = C_0_Dup2: PARTS: 1; PINSWAP: (A,B); LEVEL: STD; DEVICE: RMEMK105BJ104KV_FR; OriginalSymbolOrigin: (0,30); CODE: 8070614; %195%%232%%202%%246%: SMD陶瓷电容-16V-100NF-+/-10%-X7R-0402-BT; %182%%238%%182%%168%%185%%164%%215%%247%%181%%231%%209%%185%(V): 16; COMPONENT_HIGH_MAX: 0.55MM; %208%%161%%192%%224%%195%%251%%179%%198%: SMD陶瓷电容; PKG_TYPE: SC0402
C430 = C_0_Dup2: PARTS: 1; PINSWAP: (A,B); LEVEL: STD; DEVICE: CV05X5R105K10AH; OriginalSymbolOrigin: (0,30); CODE: 8070612; %195%%232%%202%%246%: SMD陶瓷电容-10V-1000NF-+/-10%-X5R-0402-BT,TS16949; %182%%238%%182%%168%%185%%164%%215%%247%%181%%231%%209%%185%(V): 10; COMPONENT_HIGH_MAX: 0.55MM; %208%%161%%192%%224%%195%%251%%179%%198%: SMD陶瓷电容; PKG_TYPE: SC0402
R221 = R_1: PARTS: 1; LEVEL: STD; DEVICE: RC0402FR_071KL; PINSWAP: (A,B); OriginalSymbolOrigin: (10,20); CODE: 7091282; %195%%232%%202%%246%: 片式厚膜电阻器-0.0625W-1000OHM-+/-1%-0402-BT; %182%%238%%182%%168%%185%%166%%194%%202%(W): 0.06; %215%%232%%214%%181%%212%%202%%208%%237%%198%%171%%178%%238%: +/-1%; COMPONENT_HIGH_MAX: 0.4MM; %208%%161%%192%%224%%195%%251%%179%%198%: 片式厚膜电阻器; PKG_TYPE: SR0402
R222 R325 = R_1: PARTS: 1; LEVEL: STD; DEVICE: RC0402FR_071KL; PINSWAP: (A,B); OriginalSymbolOrigin: (10,20); %208%%161%%192%%224%%195%%251%%179%%198%: 片式厚膜电阻器; COMPONENT_HIGH_MAX: 0.4MM; %215%%232%%214%%181%%212%%202%%208%%237%%198%%171%%178%%238%: +/-1%; %182%%238%%182%%168%%185%%166%%194%%202%(W): 0.06; %195%%232%%202%%246%: 片式厚膜电阻器-0.0625W-1000OHM-+/-1%-0402-BT; CODE: 7091282; PKG_TYPE: SR0402
TP15-TP18 = TESTPOINT_0: PARTS: 1; DEVICE: TEST-SMD; LEVEL: STD; OriginalSymbolOrigin: (20,20); PKG_TYPE: TP24-SMD
U8 = HI3531AV100_M2_17: FORWARD_PCB: 1; HETERO: (HI3531AV100_DDR1),(HI3531AV100_DDR2),(HI3531AV100_SYSTEM),(HI3531AV100_AD),(HI3531AV100_VO),(HI3531AV100_M1),(HI3531AV100_M2),(HI3531AV100_POWER),(HI3531AV100_VSS1),(HI3531AV100_VSS2); LEVEL: STD; OriginalSymbolOrigin: (30,630); CaptureCellPackProp: HI3531AV100_M2C; CODE: 35020607; PARTS: 1; PKG_TYPE: BGA805-32-3333

## Sheet P16 Hi3531AV100(RGMII&I.SchDoc
size 420 x 297 mm
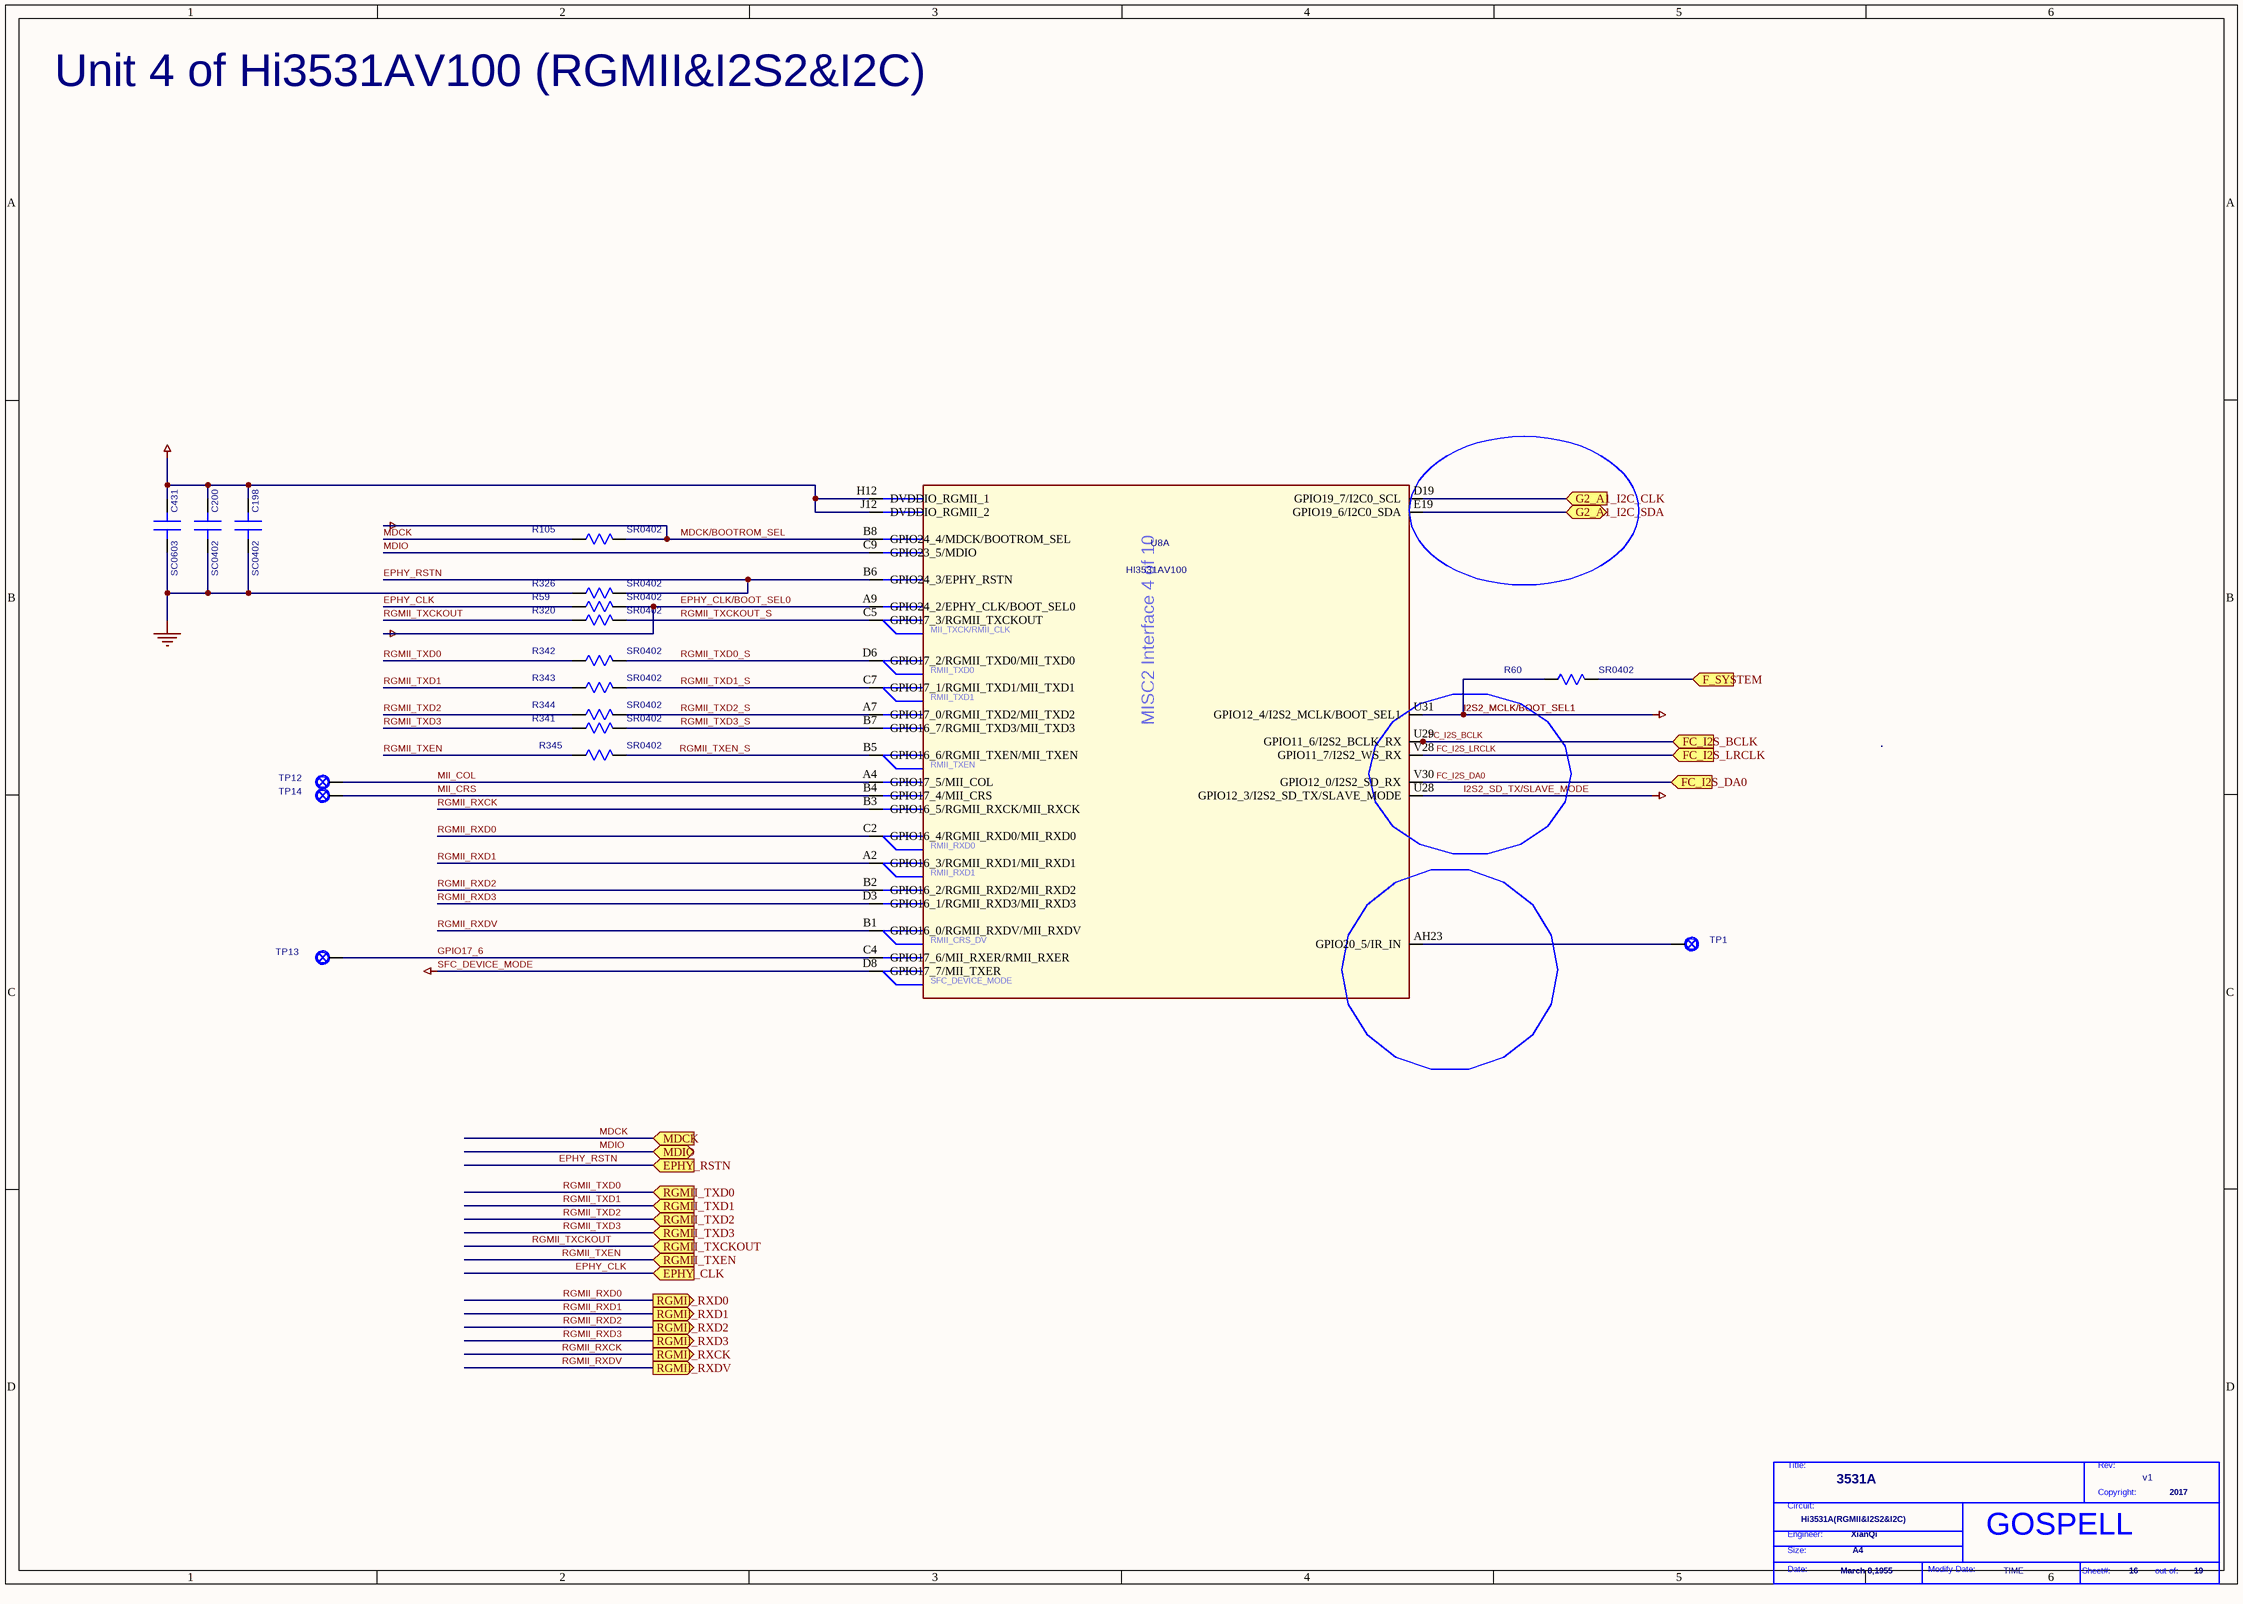
[diagram p2: P16 Hi3531AV100(RGMII&I.SchDoc]

### Parts
(Parts that share a designator on the sheet are numbered #1, #2 ... from top to bottom, then left to right.)
*#3  Page Modify Date: TIME  Engineer: XianQi  Copyright: 2017  Title: 3531A  RevCode: v1  Page Size: A4  Page Create Date: March 8,1955  Page Number: 16  Page Count: 19  Doc: Hi3531A(RGMII&I2S2&I2C)  (hidden comment: GOSPELL)  (graphical)
C198  SC0402  [SC0402]
C200  SC0402  [SC0402]
C431  SC0603  [SC0603]
R59  SR0402  [SR0402]
R60  SR0402  [SR0402]
R105  SR0402  [SR0402]
R320  SR0402  [SR0402]
R326  SR0402  [SR0402]
R341  SR0402  [SR0402]
R342  SR0402  [SR0402]
R343  SR0402  [SR0402]
R344  SR0402  [SR0402]
R345  SR0402  [SR0402]
TP1  TP24-SMD  [TP24-SMD]  (value not drawn)
TP12  TP24-SMD  [TP24-SMD]  (value not drawn)
TP13  TP24-SMD  [TP24-SMD]  (value not drawn)
TP14  TP24-SMD  [TP24-SMD]  (value not drawn)
U8  DEVICE: HI3531AV100  [BGA805-32-3333]  (hidden comment: BGA805-32-3333)  (part A of 10)

### Ports
EPHY_CLK (in), EPHY_RSTN (in), F_SYSTEM (in), FC_I2S_BCLK (in), FC_I2S_DA0 (in), FC_I2S_LRCLK (in), G2_A1_I2C_CLK (in), G2_A1_I2C_SDA (bidir), MDCK (in), MDIO (bidir), RGMII_RXCK (out), RGMII_RXD0 (out), RGMII_RXD1 (out), RGMII_RXD2 (out), RGMII_RXD3 (out), RGMII_RXDV (out), RGMII_TXCKOUT (in), RGMII_TXD0 (in), RGMII_TXD1 (in), RGMII_TXD2 (in), RGMII_TXD3 (in), RGMII_TXEN (in)

### Nets
3V3: C198.1(A) C200.1(A) C431.1(A) U8.H12(DVDDIO_RGMII_1) U8.J12(DVDDIO_RGMII_2)
EPHY_CLK/BOOT_SEL0: R59.2(B) U8.A9(GPIO24_2/EPHY_CLK/BOOT_SEL0)
GND: C198.2(B) C200.2(B) C431.2(B) R326.1(A)
I2S2_MCLK/BOOT_SEL1: R60.1(A) U8.U31(GPIO12_4/I2S2_MCLK/BOOT_SEL1)
I2S2_SD_TX/SLAVE_MODE: U8.U28(GPIO12_3/I2S2_SD_TX/SLAVE_MODE)
MDCK/BOOTROM_SEL: R105.2(B) U8.B8(GPIO24_4/MDCK/BOOTROM_SEL)
SFC_DEVICE_MODE: U8.D8(GPIO17_7/MII_TXER)
EPHY_CLK: R59.1(A) ; port EPHY_CLK
EPHY_RSTN: R326.2(B) U8.B6(GPIO24_3/EPHY_RSTN) ; port EPHY_RSTN
FC_I2S_BCLK: U8.U29(GPIO11_6/I2S2_BCLK_RX) ; port FC_I2S_BCLK
FC_I2S_DA0: U8.V30(GPIO12_0/I2S2_SD_RX) ; port FC_I2S_DA0
FC_I2S_LRCLK: U8.V28(GPIO11_7/I2S2_WS_RX) ; port FC_I2S_LRCLK
G2_A1_I2C_CLK: U8.D19(GPIO19_7/I2C0_SCL) ; port G2_A1_I2C_CLK
G2_A1_I2C_SDA: U8.E19(GPIO19_6/I2C0_SDA) ; port G2_A1_I2C_SDA
GPIO17_6: TP13.1 U8.C4(GPIO17_6/MII_RXER/RMII_RXER)
MDCK: R105.1(A) ; port MDCK
MDIO: U8.C9(GPIO23_5/MDIO) ; port MDIO
MII_COL: TP12.1 U8.A4(GPIO17_5/MII_COL)
MII_CRS: TP14.1 U8.B4(GPIO17_4/MII_CRS)
RGMII_RXCK: U8.B3(GPIO16_5/RGMII_RXCK/MII_RXCK) ; port RGMII_RXCK
RGMII_RXD0: U8.C2(GPIO16_4/RGMII_RXD0/MII_RXD0) ; port RGMII_RXD0
RGMII_RXD1: U8.A2(GPIO16_3/RGMII_RXD1/MII_RXD1) ; port RGMII_RXD1
RGMII_RXD2: U8.B2(GPIO16_2/RGMII_RXD2/MII_RXD2) ; port RGMII_RXD2
RGMII_RXD3: U8.D3(GPIO16_1/RGMII_RXD3/MII_RXD3) ; port RGMII_RXD3
RGMII_RXDV: U8.B1(GPIO16_0/RGMII_RXDV/MII_RXDV) ; port RGMII_RXDV
RGMII_TXCKOUT: R320.1(A) ; port RGMII_TXCKOUT
RGMII_TXCKOUT_S: R320.2(B) U8.C5(GPIO17_3/RGMII_TXCKOUT)
RGMII_TXD0: R342.1(A) ; port RGMII_TXD0
RGMII_TXD0_S: R342.2(B) U8.D6(GPIO17_2/RGMII_TXD0/MII_TXD0)
RGMII_TXD1: R343.1(A) ; port RGMII_TXD1
RGMII_TXD1_S: R343.2(B) U8.C7(GPIO17_1/RGMII_TXD1/MII_TXD1)
RGMII_TXD2: R344.1(A) ; port RGMII_TXD2
RGMII_TXD2_S: R344.2(B) U8.A7(GPIO17_0/RGMII_TXD2/MII_TXD2)
RGMII_TXD3: R341.1(A) ; port RGMII_TXD3
RGMII_TXD3_S: R341.2(B) U8.B7(GPIO16_7/RGMII_TXD3/MII_TXD3)
RGMII_TXEN: R345.1(A) ; port RGMII_TXEN
RGMII_TXEN_S: R345.2(B) U8.B5(GPIO16_6/RGMII_TXEN/MII_TXEN)
NetJ41_2: R60.2(B) ; port F_SYSTEM
NetTP1_1: TP1.1 U8.AH23(GPIO20_5/IR_IN)

### Notes on the sheet
- Unit 4 of Hi3531AV100 (RGMII&I2S2&I2C)
- (in symbol GOSPELL) Title:; Rev:; Copyright:; Circuit:; Engineer:; Size:; Date:; Modify Date:; Sheet#:; out of:
- (in symbol HI3531AV100_M2_17, part A) MII_TXCK/RMII_CLK; RMII_TXD0; RMII_TXD1; MISC2 Interface 4 of 10; RMII_TXEN; RMII_RXD0; RMII_RXD1; RMII_CRS_DV; SFC_DEVICE_MODE

### Library data of the parts
C198 = C_0_Dup2: PARTS: 1; PINSWAP: (A,B); LEVEL: STD; DEVICE: RMEMK105BJ104KV_FR; OriginalSymbolOrigin: (0,30); %208%%161%%192%%224%%195%%251%%179%%198%: SMD陶瓷电容; COMPONENT_HIGH_MAX: 0.55MM; %182%%238%%182%%168%%185%%164%%215%%247%%181%%231%%209%%185%(V): 16; %195%%232%%202%%246%: SMD陶瓷电容-16V-100NF-+/-10%-X7R-0402-BT; CODE: 8070614; PKG_TYPE: SC0402
C200 = C_0_Dup2: as C199 on sheet P17 Hi3531AV100 (AD); PKG_TYPE: SC0402
C431 = C_0_Dup2: PARTS: 1; PINSWAP: (A,B); LEVEL: STD; DEVICE: C1608X5R0J106MT0A0E; OriginalSymbolOrigin: (0,30); %208%%161%%192%%224%%195%%251%%179%%198%: SMD陶瓷电容; COMPONENT_HIGH_MAX: 0.9MM; %182%%238%%182%%168%%185%%164%%215%%247%%181%%231%%209%%185%(V): 6.3; %195%%232%%202%%246%: SMD陶瓷电容-6.3V-10000NF-+/-20%-X5R-0603-BT,TS16949; CODE: 8070649; PKG_TYPE: SC0603
R59 R105 R320 R344 = R_1: as R4 on sheet P18 CONNECT DDR1; PKG_TYPE: SR0402
R60 R341-R343 R345 = R_1: as R100 on sheet P18 CONNECT DDR1; PKG_TYPE: SR0402
R326 = R_1: as R222 on sheet P17 Hi3531AV100 (AD); PKG_TYPE: SR0402
TP1 TP12-TP14 = TESTPOINT_0: as TP15 on sheet P17 Hi3531AV100 (AD); PKG_TYPE: TP24-SMD
U8 = HI3531AV100_M2_17: FORWARD_PCB: 1; HETERO: (HI3531AV100_DDR1),(HI3531AV100_DDR2),(HI3531AV100_SYSTEM),(HI3531AV100_AD),(HI3531AV100_VO),(HI3531AV100_M1),(HI3531AV100_M2),(HI3531AV100_POWER),(HI3531AV100_VSS1),(HI3531AV100_VSS2); LEVEL: STD; OriginalSymbolOrigin: (30,630); CaptureCellPackProp: HI3531AV100_M2A; CODE: 35020607; PARTS: 1; PKG_TYPE: BGA805-32-3333

## Sheet P15 Hi3531AV100(VO&I2S3.SchDoc
size 420 x 297 mm
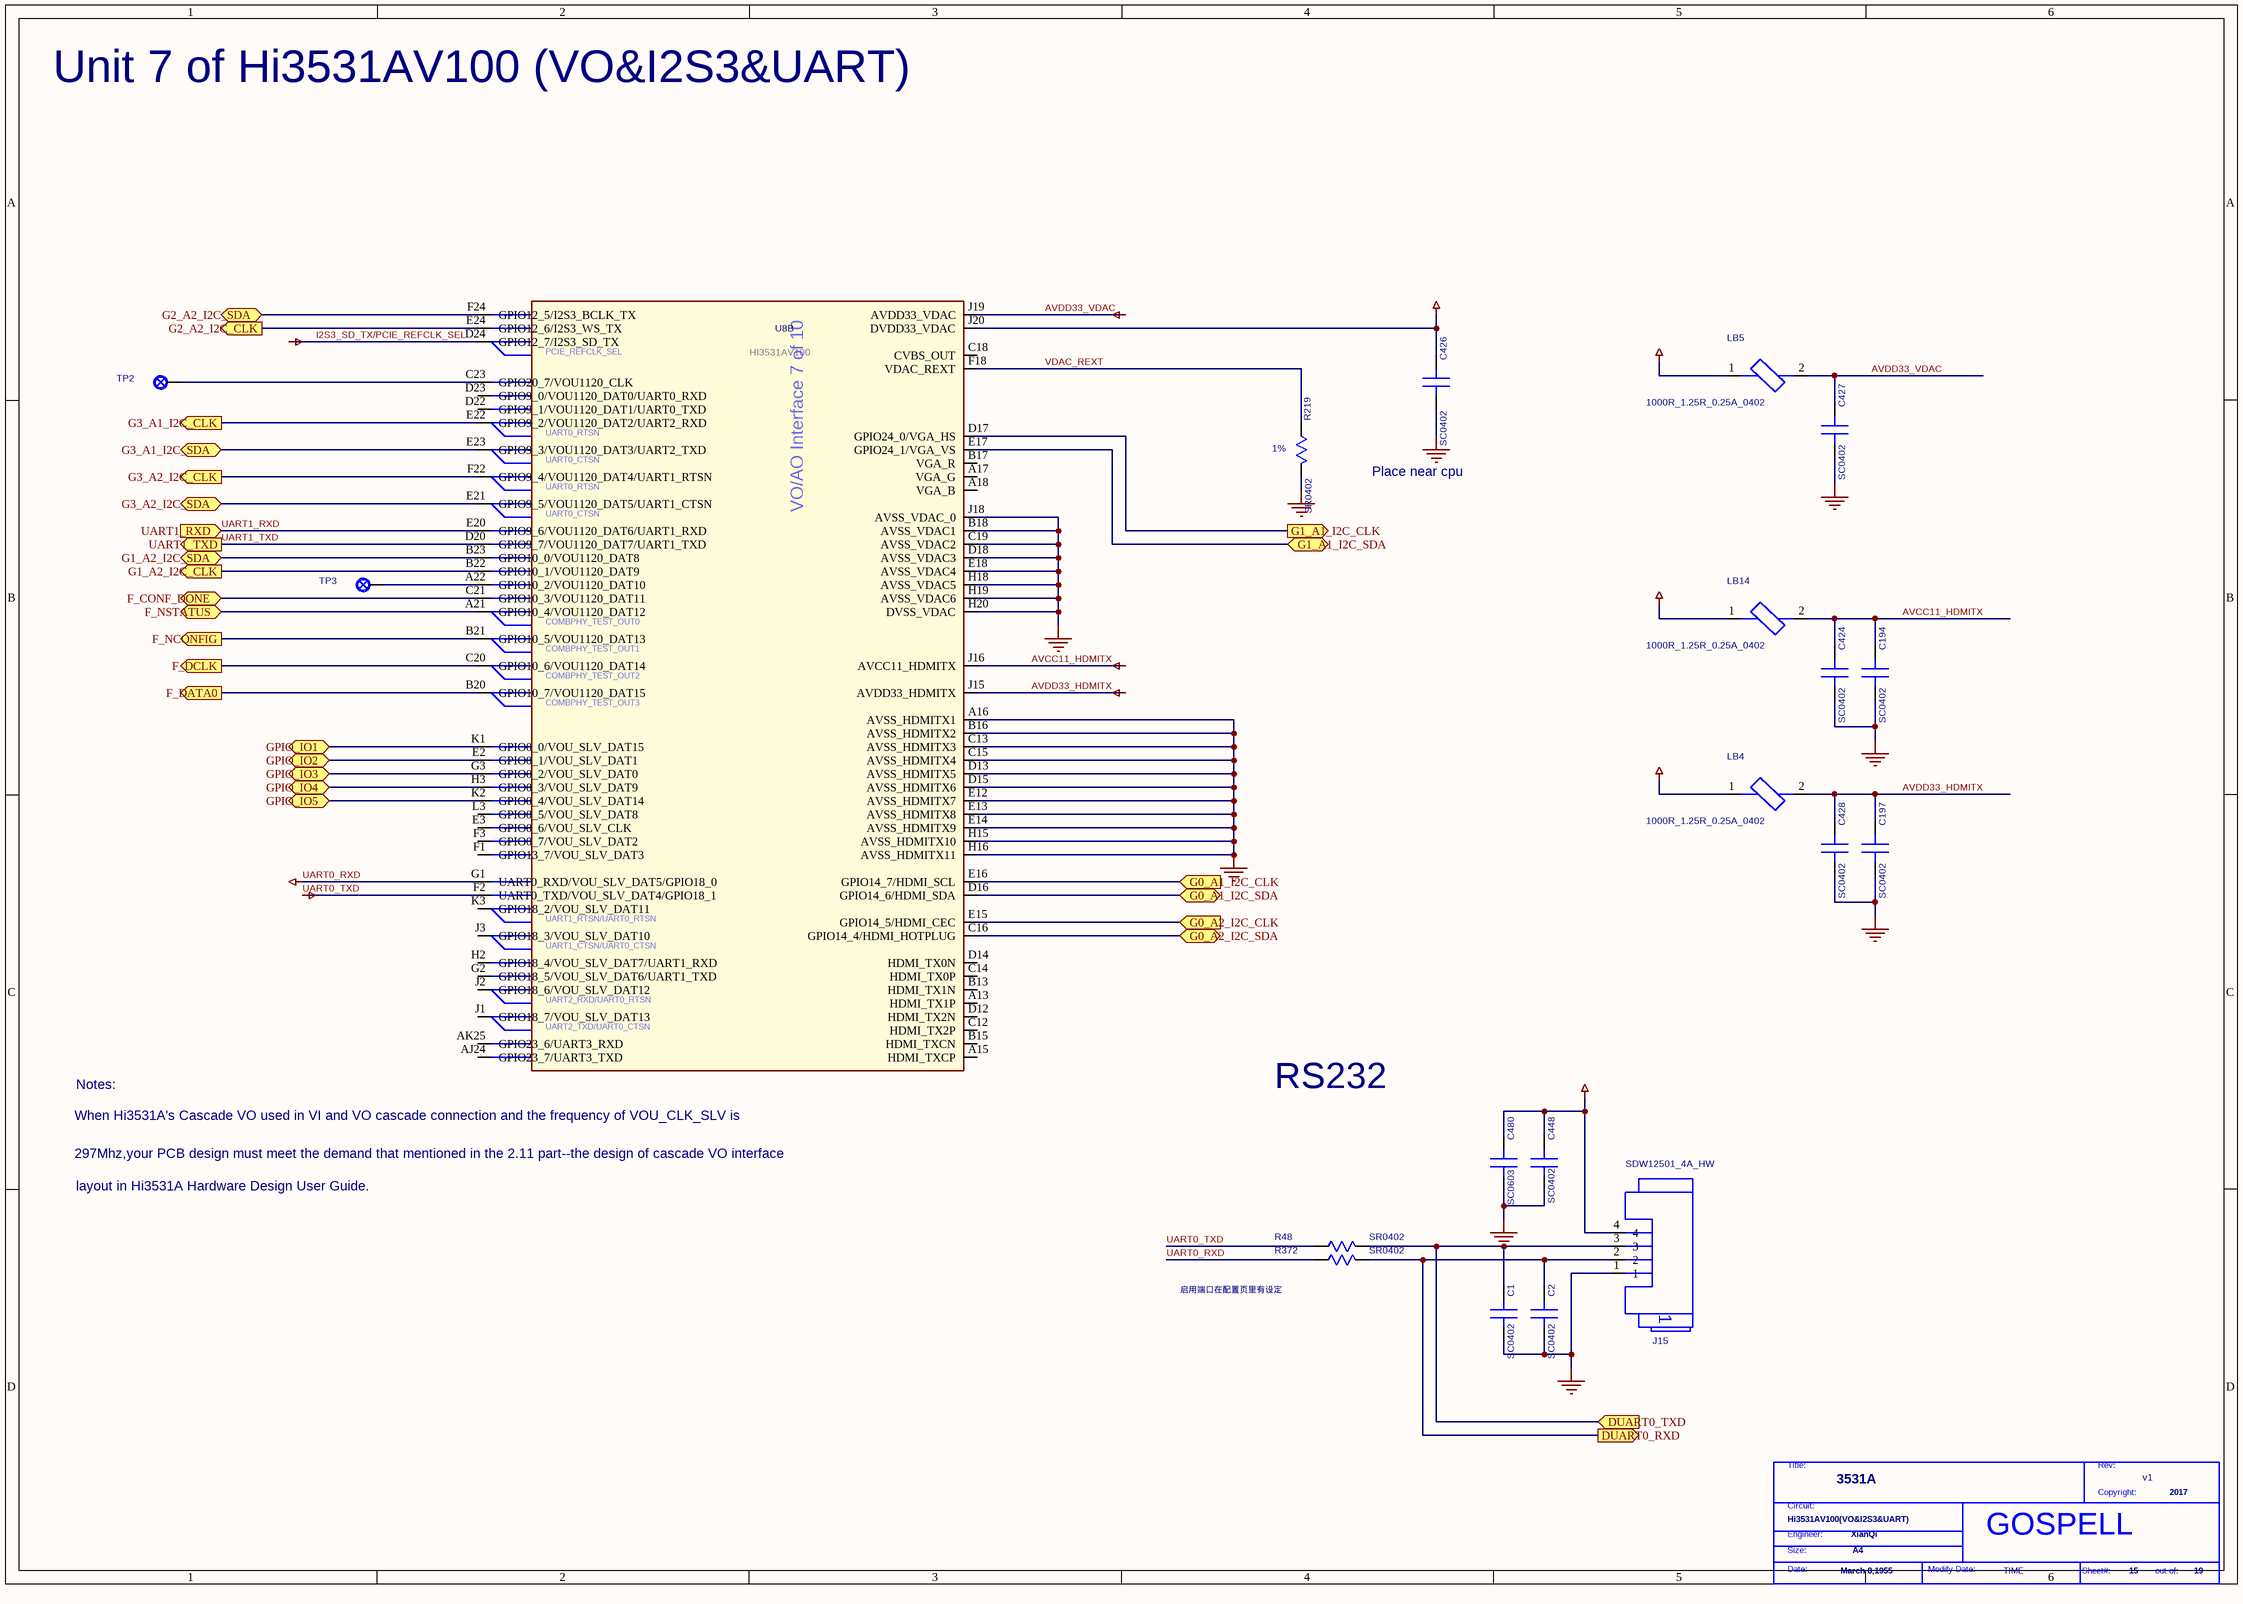
[diagram p3: P15 Hi3531AV100(VO&I2S3.SchDoc]

### Parts
(Parts that share a designator on the sheet are numbered #1, #2 ... from top to bottom, then left to right.)
*#4  Page Modify Date: TIME  Engineer: XianQi  Copyright: 2017  Title: 3531A  RevCode: v1  Page Size: A4  Page Create Date: March 8,1955  Page Number: 15  Page Count: 19  Doc: Hi3531AV100(VO&I2S3&UART)  (hidden comment: GOSPELL)  (graphical)
C1  SC0402  [SC0402]
C2  SC0402  [SC0402]
C194  SC0402  [SC0402]
C197  SC0402  [SC0402]
C424  SC0402  [SC0402]
C426  SC0402  [SC0402]
C427  SC0402  [SC0402]
C428  SC0402  [SC0402]
C448  SC0402  [SC0402]
C480  SC0603  [SC0603]
J15  DEVICE: SDW12501_4A_HW  [4PIN-2.54]  (hidden comment: 4PIN-2.54)
LB4  SL0402  [SL0402]  (value not drawn)
LB5  SL0402  [SL0402]  (value not drawn)
LB14  SL0402  [SL0402]  (value not drawn)
R48  SR0402  [SR0402]
R219  SR0402  [SR0402]
R372  SR0402  [SR0402]
TP2  TP24-SMD  [TP24-SMD]  (value not drawn)
TP3  TP24-SMD  [TP24-SMD]  (value not drawn)
U8  DEVICE: HI3531AV100  [BGA805-32-3333]  (hidden comment: BGA805-32-3333)  (part B of 10)

### Ports
DUART0_RXD (out), DUART0_TXD (in), F_CONF_DONE (bidir), F_DATA0 (out), F_DCLK (out), F_NCONFIG (out), F_NSTATUS (bidir), G0_A1_I2C_CLK (in), G0_A1_I2C_SDA (bidir), G0_A2_I2C_CLK (in), G0_A2_I2C_SDA (bidir), G1_A1_I2C_CLK (out), G1_A1_I2C_SDA (bidir), G1_A2_I2C_CLK (out), G1_A2_I2C_SDA (bidir), G2_A2_I2C_CLK (out), G2_A2_I2C_SDA (bidir), G3_A1_I2C_CLK (out), G3_A1_I2C_SDA (bidir), G3_A2_I2C_CLK (out), G3_A2_I2C_SDA (bidir), GPIO_IO1 (bidir), GPIO_IO2 (bidir), GPIO_IO3 (bidir), GPIO_IO4 (bidir), GPIO_IO5 (bidir), UART1_RXD (in), UART1_TXD (out)

### Nets
3V3: C426.1(A) C448.1(A) C480.1(A) J15.4 LB4.1 LB5.1 U8.J20(DVDD33_VDAC)
AVCC11_HDMITX: C194.1(A) C424.1(A) LB14.2 U8.J16(AVCC11_HDMITX)
AVDD33_HDMITX: C197.1(A) C428.1(A) LB4.2 U8.J15(AVDD33_HDMITX)
AVDD33_VDAC: C427.1(A) LB5.2 U8.J19(AVDD33_VDAC)
DVDD_CORE: LB14.1
GND: C1.2(B) C2.2(B) C194.2(B) C197.2(B) C424.2(B) C426.2(B) C427.2(B) C428.2(B) C448.2(B) C480.2(B) J15.1 R219.2(B) U8.A16(AVSS_HDMITX1) U8.B16(AVSS_HDMITX2) U8.B18(AVSS_VDAC1) U8.C13(AVSS_HDMITX3) U8.C15(AVSS_HDMITX4) U8.C19(AVSS_VDAC2) U8.D13(AVSS_HDMITX5) U8.D15(AVSS_HDMITX6) U8.D18(AVSS_VDAC3) U8.E12(AVSS_HDMITX7) U8.E13(AVSS_HDMITX8) U8.E14(AVSS_HDMITX9) U8.E18(AVSS_VDAC4) U8.H15(AVSS_HDMITX10) U8.H16(AVSS_HDMITX11) U8.H18(AVSS_VDAC5) U8.H19(AVSS_VDAC6) U8.H20(DVSS_VDAC) U8.J18(AVSS_VDAC_0)
I2S3_SD_TX/PCIE_REFCLK_SEL: U8.D24(GPIO12_7/I2S3_SD_TX)
UART0_RXD: R372.1(A) U8.G1(UART0_RXD/VOU_SLV_DAT5/GPIO18_0)
UART0_TXD: R48.1(A) U8.F2(UART0_TXD/VOU_SLV_DAT4/GPIO18_1)
G0_A1_I2C_CLK: U8.E16(GPIO14_7/HDMI_SCL) ; port G0_A1_I2C_CLK
G0_A1_I2C_SDA: U8.D16(GPIO14_6/HDMI_SDA) ; port G0_A1_I2C_SDA
G0_A2_I2C_CLK: U8.E15(GPIO14_5/HDMI_CEC) ; port G0_A2_I2C_CLK
G0_A2_I2C_SDA: U8.C16(GPIO14_4/HDMI_HOTPLUG) ; port G0_A2_I2C_SDA
G1_A1_I2C_CLK: U8.D17(GPIO24_0/VGA_HS) ; port G1_A1_I2C_CLK
G1_A1_I2C_SDA: U8.E17(GPIO24_1/VGA_VS) ; port G1_A1_I2C_SDA
G1_A2_I2C_CLK: U8.B22(GPIO10_1/VOU1120_DAT9) ; port G1_A2_I2C_CLK
G1_A2_I2C_SDA: U8.B23(GPIO10_0/VOU1120_DAT8) ; port G1_A2_I2C_SDA
G2_A2_I2C_CLK: U8.E24(GPIO12_6/I2S3_WS_TX) ; port G2_A2_I2C_CLK
G2_A2_I2C_SDA: U8.F24(GPIO12_5/I2S3_BCLK_TX) ; port G2_A2_I2C_SDA
G3_A1_I2C_CLK: U8.E22(GPIO9_2/VOU1120_DAT2/UART2_RXD) ; port G3_A1_I2C_CLK
G3_A1_I2C_SDA: U8.E23(GPIO9_3/VOU1120_DAT3/UART2_TXD) ; port G3_A1_I2C_SDA
G3_A2_I2C_CLK: U8.F22(GPIO9_4/VOU1120_DAT4/UART1_RTSN) ; port G3_A2_I2C_CLK
G3_A2_I2C_SDA: U8.E21(GPIO9_5/VOU1120_DAT5/UART1_CTSN) ; port G3_A2_I2C_SDA
UART1_RXD: U8.E20(GPIO9_6/VOU1120_DAT6/UART1_RXD) ; port UART1_RXD
UART1_TXD: U8.D20(GPIO9_7/VOU1120_DAT7/UART1_TXD) ; port UART1_TXD
VDAC_REXT: R219.1(A) U8.F18(VDAC_REXT)
NetC1_1: C1.1(A) J15.3 R48.2(B) ; port DUART0_TXD
NetC2_1: C2.1(A) J15.2 R372.2(B) ; port DUART0_RXD
NetR4_1: U8.K2(GPIO0_4/VOU_SLV_DAT14) ; port GPIO_IO5
NetR5_1: U8.H3(GPIO0_3/VOU_SLV_DAT9) ; port GPIO_IO4
NetR6_1: U8.G3(GPIO0_2/VOU_SLV_DAT0) ; port GPIO_IO3
NetR9_1: U8.E2(GPIO0_1/VOU_SLV_DAT1) ; port GPIO_IO2
NetR10_1: U8.K1(GPIO0_0/VOU_SLV_DAT15) ; port GPIO_IO1
NetR104_1: U8.A21(GPIO10_4/VOU1120_DAT12) ; port F_NSTATUS
NetR108_1: U8.C20(GPIO10_6/VOU1120_DAT14) ; port F_DCLK
NetR109_1: U8.B20(GPIO10_7/VOU1120_DAT15) ; port F_DATA0
NetR110_1: U8.C21(GPIO10_3/VOU1120_DAT11) ; port F_CONF_DONE
NetR112_1: U8.B21(GPIO10_5/VOU1120_DAT13) ; port F_NCONFIG
NetTP2_1: TP2.1 U8.C23(GPIO20_7/VOU1120_CLK)
NetTP3_1: TP3.1 U8.A22(GPIO10_2/VOU1120_DAT10)

Not connected (* = marked no-connect by the designer): U8 A13(HDMI_TX1P) A15(HDMI_TXCP) A17(VGA_G) A18(VGA_B) AJ24(GPIO23_7/UART3_TXD) AK25(GPIO23_6/UART3_RXD) B13(HDMI_TX1N) B15(HDMI_TXCN) B17(VGA_R) C12(HDMI_TX2P) C14(HDMI_TX0P) C18(CVBS_OUT) D12(HDMI_TX2N) D14(HDMI_TX0N) D22(GPIO9_1/VOU1120_DAT1/UART0_TXD) D23(GPIO9_0/VOU1120_DAT0/UART0_RXD) E3(GPIO0_6/VOU_SLV_CLK) F1(GPIO13_7/VOU_SLV_DAT3) F3(GPIO0_7/VOU_SLV_DAT2) G2(GPIO18_5/VOU_SLV_DAT6/UART1_TXD) H2(GPIO18_4/VOU_SLV_DAT7/UART1_RXD) J1(GPIO18_7/VOU_SLV_DAT13) J2(GPIO18_6/VOU_SLV_DAT12) J3(GPIO18_3/VOU_SLV_DAT10) K3(GPIO18_2/VOU_SLV_DAT11) L3(GPIO0_5/VOU_SLV_DAT8)

### Notes on the sheet
- Unit 7 of Hi3531AV100 (VO&I2S3&UART)
- (near R219) 1%
- (near LB5) 1000R_1.25R_0.25A_0402
- Place near cpu
- (near LB14) 1000R_1.25R_0.25A_0402
- (near LB4) 1000R_1.25R_0.25A_0402
- (near U8) When Hi3531A's Cascade VO used in VI and VO cascade connection and the frequency of VOU_CLK_SLV is
- Notes:
- RS232
- 297Mhz,your PCB design must meet the demand that mentioned in the 2.11 part--the design of cascade VO interface
- layout in Hi3531A Hardware Design User Guide.
- 启用端口在配置页里有设定
- (in symbol GOSPELL) Title:; Rev:; Copyright:; Circuit:; Engineer:; Size:; Date:; Modify Date:; Sheet#:; out of:
- (in symbol HI3531AV100_M2_17, part B) PCIE_REFCLK_SEL; UART0_RTSN; UART0_CTSN; VO/AO Interface 7 of 10; COMBPHY_TEST_OUT0; COMBPHY_TEST_OUT1; COMBPHY_TEST_OUT2; COMBPHY_TEST_OUT3; UART1_RTSN/UART0_RTSN; UART1_CTSN/UART0_CTSN; UART2_RXD/UART0_RTSN; UART2_TXD/UART0_CTSN

### Library data of the parts
C1 = C_0_Dup1: PARTS: 1; OriginalSymbolOrigin: (0,30); DEVICE: 04025C102KAT2A; LEVEL: STD; PINSWAP: (A,B); %208%%161%%192%%224%%195%%251%%179%%198%: SMD陶瓷电容; COMPONENT_HIGH_MAX: 0.56MM; %182%%238%%182%%168%%185%%164%%215%%247%%181%%231%%209%%185%(V): 50; %195%%232%%202%%246%: SMD陶瓷电容-50V-1NF-+/-10%-X7R-0402-BT; CODE: 8070531; PKG_TYPE: SC0402
C2 = C_0_Dup1: PARTS: 1; OriginalSymbolOrigin: (0,30); DEVICE: 04025C102KAT2A; LEVEL: STD; PINSWAP: (A,B); CODE: 8070531; %195%%232%%202%%246%: SMD陶瓷电容-50V-1NF-+/-10%-X7R-0402-BT; %182%%238%%182%%168%%185%%164%%215%%247%%181%%231%%209%%185%(V): 50; COMPONENT_HIGH_MAX: 0.56MM; %208%%161%%192%%224%%195%%251%%179%%198%: SMD陶瓷电容; PKG_TYPE: SC0402
C194 = C_0_Dup2: as C175 on sheet P17 Hi3531AV100 (AD); PKG_TYPE: SC0402
C197 = C_0_Dup2: as C153 on sheet P17 Hi3531AV100 (AD); PKG_TYPE: SC0402
C424 C426-C428 = C_0_Dup2: PARTS: 1; PINSWAP: (A,B); LEVEL: STD; DEVICE: CV05X5R105K10AH; OriginalSymbolOrigin: (0,30); %208%%161%%192%%224%%195%%251%%179%%198%: SMD陶瓷电容; COMPONENT_HIGH_MAX: 0.55MM; %182%%238%%182%%168%%185%%164%%215%%247%%181%%231%%209%%185%(V): 10; %195%%232%%202%%246%: SMD陶瓷电容-10V-1000NF-+/-10%-X5R-0402-BT,TS16949; CODE: 8070612; PKG_TYPE: SC0402
C448 = C_0_Dup2: as C198 on sheet P16 Hi3531AV100(RGMII&I; PKG_TYPE: SC0402
C480 = C_0_Dup2: PARTS: 1; PINSWAP: (A,B); LEVEL: STD; DEVICE: C1608X5R0J106MT0A0E; OriginalSymbolOrigin: (0,30); CODE: 8070649; %195%%232%%202%%246%: SMD陶瓷电容-6.3V-10000NF-+/-20%-X5R-0603-BT,TS16949; %182%%238%%182%%168%%185%%164%%215%%247%%181%%231%%209%%185%(V): 6.3; COMPONENT_HIGH_MAX: 0.9MM; %208%%161%%192%%224%%195%%251%%179%%198%: SMD陶瓷电容; PKG_TYPE: SC0603
J15 = WBC1X41_0: PARTS: 1; OriginalSymbolOrigin: (10,130); CODE: 14100167; PKG_TYPE: WBC0104-49T; LEVEL: STD; %208%%161%%192%%224%%195%%251%%179%%198%: 普通插座; COMPONENT_HIGH_MAX: 4.2MM; %195%%232%%202%%246%: 普通插座-4PIN-单排-直式-1.25MM-2MM-THT-1A
LB4 = LB_0: PARTS: 1; DEVICE: BLM15HG102SN1D; LEVEL: STD; OriginalSymbolOrigin: (20,50); CODE: 10070019; %195%%232%%202%%246%: EMI磁珠-+/-25%-1000OHM-1.25OHM-0.25A-0402-1400OHM@1GHZ-1400OHM@1GHZ; COMPONENT_HIGH_MAX: 0.55MM; %208%%161%%192%%224%%195%%251%%179%%198%: EMI磁珠; PKG_TYPE: SL0402
LB5 LB14 = LB_0: PARTS: 1; DEVICE: BLM15HG102SN1D; LEVEL: STD; OriginalSymbolOrigin: (20,50); %208%%161%%192%%224%%195%%251%%179%%198%: EMI磁珠; COMPONENT_HIGH_MAX: 0.55MM; %195%%232%%202%%246%: EMI磁珠-+/-25%-1000OHM-1.25OHM-0.25A-0402-1400OHM@1GHZ-1400OHM@1GHZ; CODE: 10070019; PKG_TYPE: SL0402
R48 R372 = R_1: as R100 on sheet P18 CONNECT DDR1; PKG_TYPE: SR0402
R219 = R_1: PARTS: 1; LEVEL: STD; DEVICE: RC0402FR_0712K; PINSWAP: (A,B); OriginalSymbolOrigin: (10,20); %208%%161%%192%%224%%195%%251%%179%%198%: 片式厚膜电阻器; COMPONENT_HIGH_MAX: 0.4MM; %215%%232%%214%%181%%212%%202%%208%%237%%198%%171%%178%%238%: +/-1%; %182%%238%%182%%168%%185%%166%%194%%202%(W): 0.06; %195%%232%%202%%246%: 片式厚膜电阻器-0.0625W-12000OHM-+/-1%-0402; CODE: 7090817; PKG_TYPE: SR0402
TP2 TP3 = TESTPOINT_0: as TP15 on sheet P17 Hi3531AV100 (AD); PKG_TYPE: TP24-SMD
U8 = HI3531AV100_M2_17: FORWARD_PCB: 1; HETERO: (HI3531AV100_DDR1),(HI3531AV100_DDR2),(HI3531AV100_SYSTEM),(HI3531AV100_AD),(HI3531AV100_VO),(HI3531AV100_M1),(HI3531AV100_M2),(HI3531AV100_POWER),(HI3531AV100_VSS1),(HI3531AV100_VSS2); LEVEL: STD; OriginalSymbolOrigin: (30,630); CaptureCellPackProp: HI3531AV100_M2B; CODE: 35020607; PARTS: 1; PKG_TYPE: BGA805-32-3333

## Sheet P14 Hi3531AV100(SATA&PC.SchDoc
size 420 x 297 mm
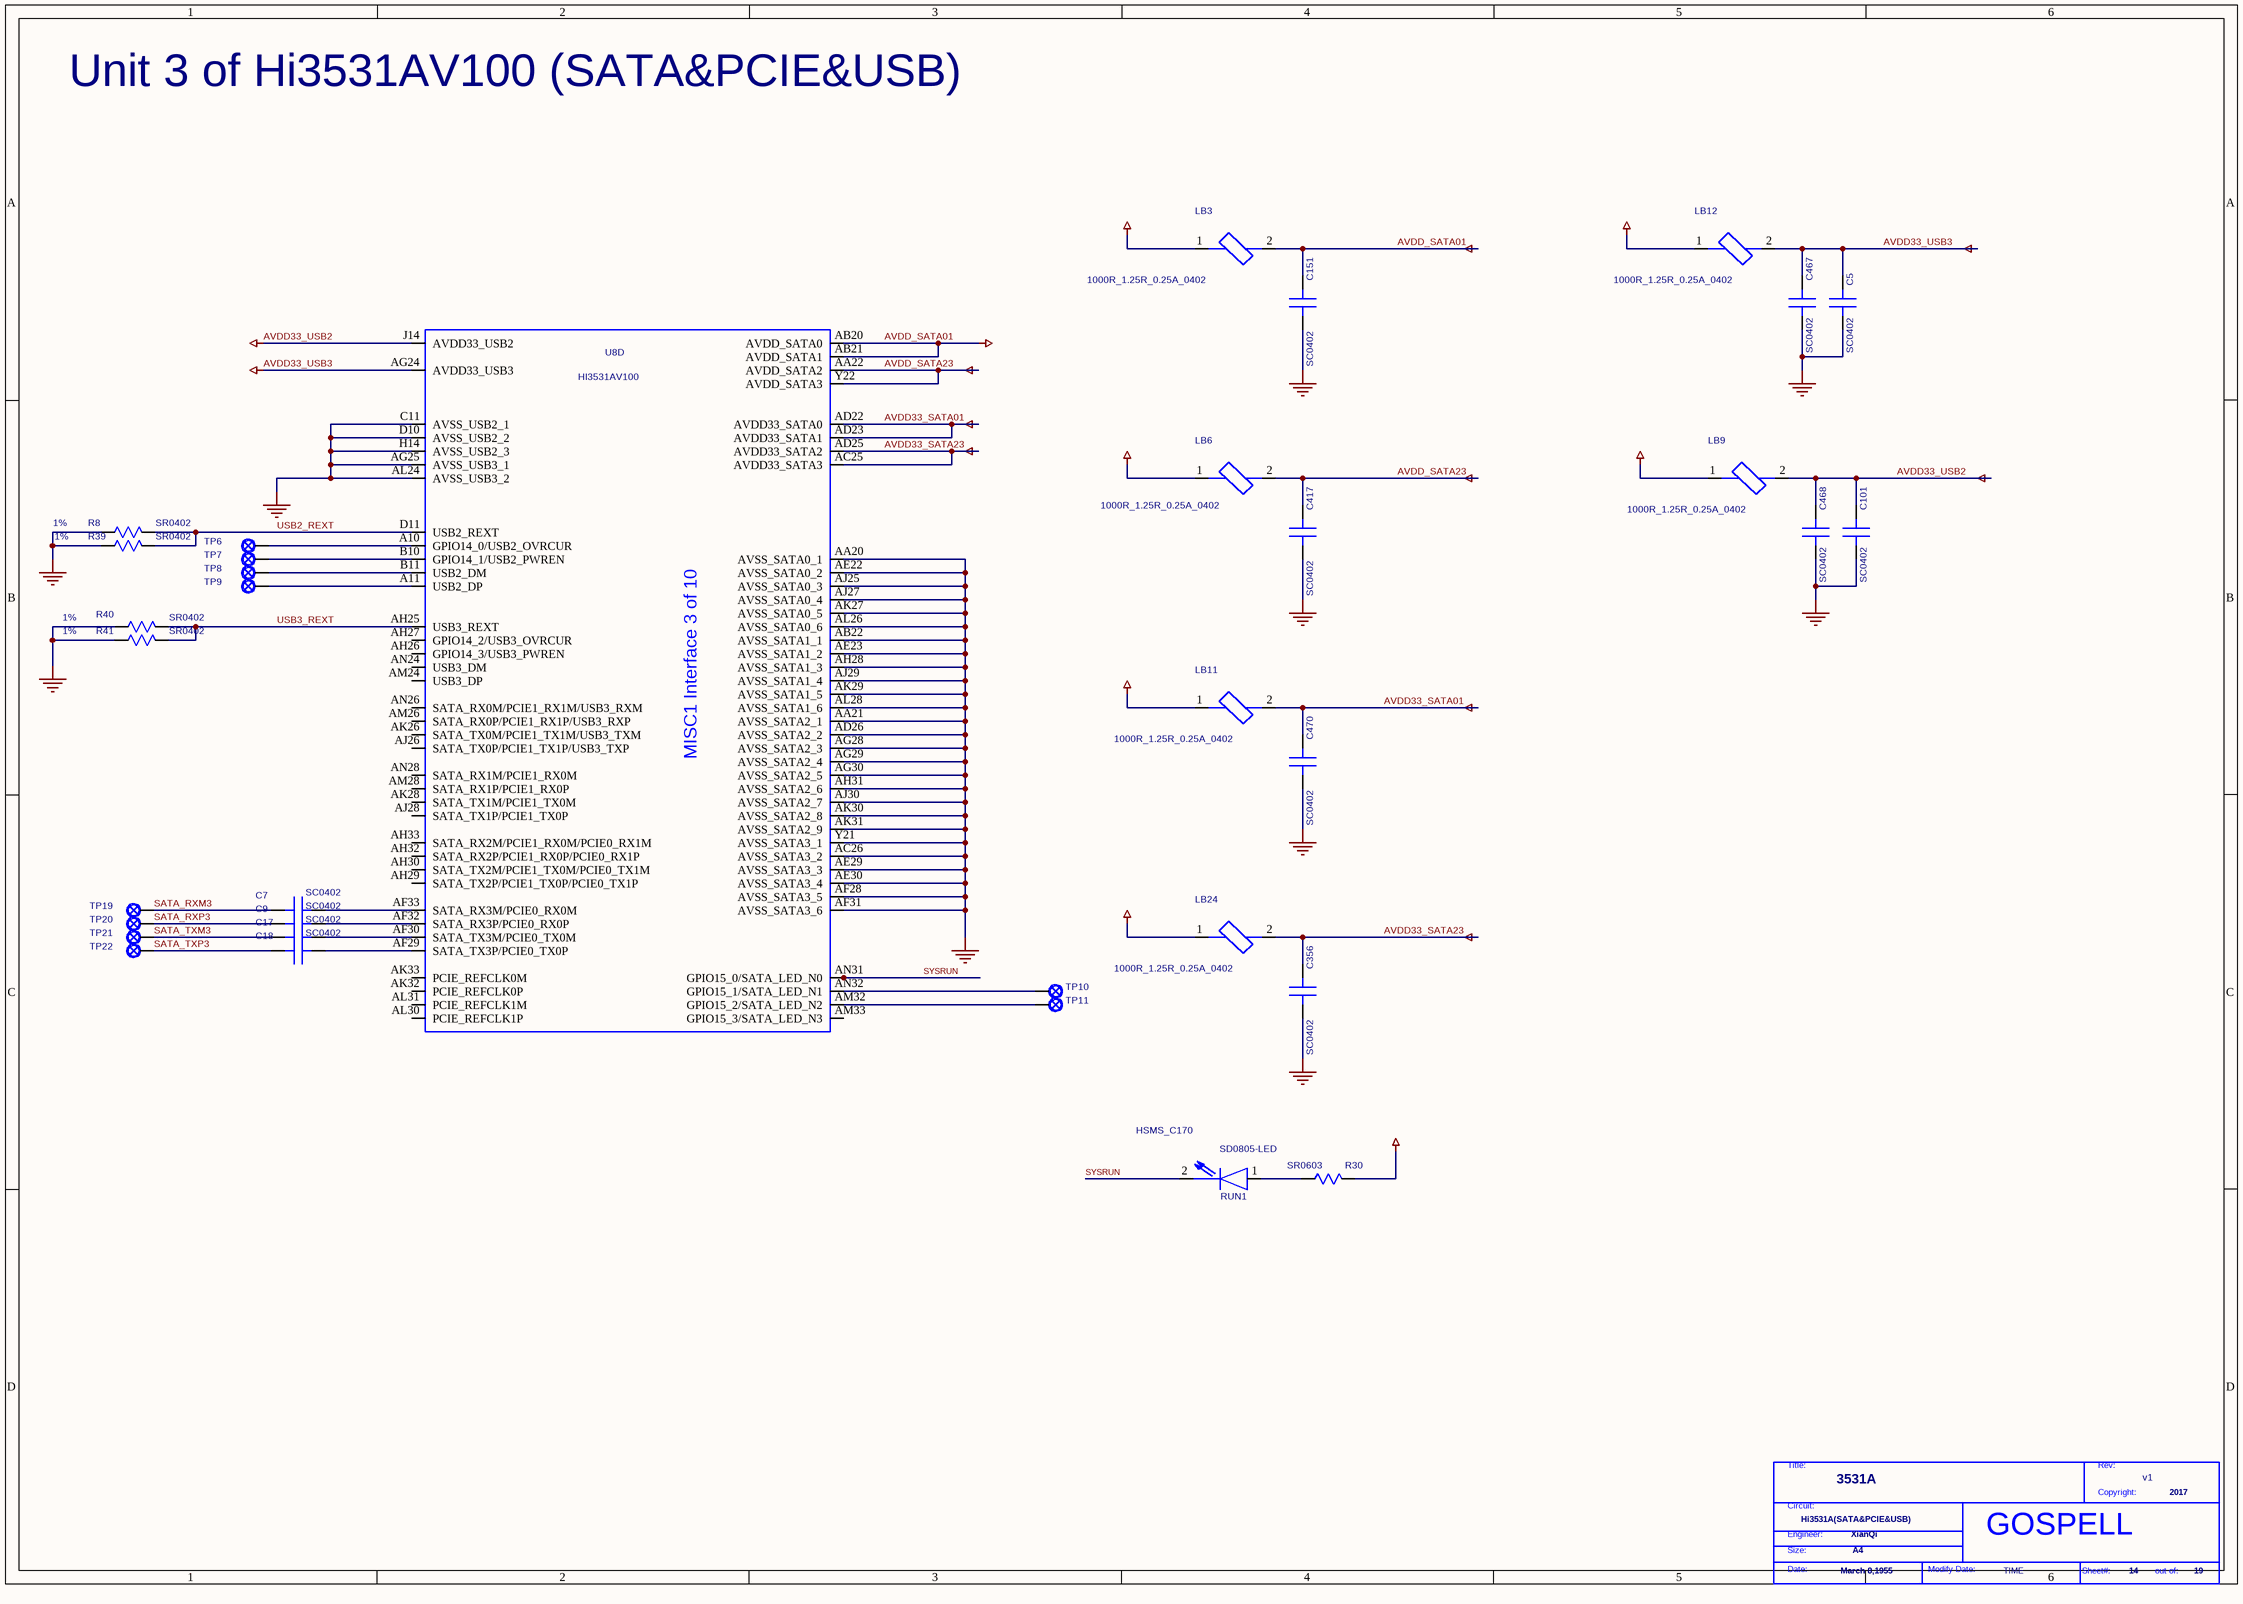
[diagram p4: P14 Hi3531AV100(SATA&PC.SchDoc]

### Parts
(Parts that share a designator on the sheet are numbered #1, #2 ... from top to bottom, then left to right.)
*#5  Page Modify Date: TIME  Engineer: XianQi  Copyright: 2017  Title: 3531A  RevCode: v1  Page Size: A4  Page Create Date: March 8,1955  Page Number: 14  Page Count: 19  Doc: Hi3531A(SATA&PCIE&USB)  (hidden comment: GOSPELL)  (graphical)
C5  SC0402  [SC0402]
C7  SC0402  [SC0402]
C9  SC0402  [SC0402]
C17  SC0402  [SC0402]
C18  SC0402  [SC0402]
C101  SC0402  [SC0402]
C151  SC0402  [SC0402]
C356  SC0402  [SC0402]
C417  SC0402  [SC0402]
C467  SC0402  [SC0402]
C468  SC0402  [SC0402]
C470  SC0402  [SC0402]
LB3  SL0402  [SL0402]  (value not drawn)
LB6  SL0402  [SL0402]  (value not drawn)
LB9  SL0402  [SL0402]  (value not drawn)
LB11  SL0402  [SL0402]  (value not drawn)
LB12  SL0402  [SL0402]  (value not drawn)
LB24  SL0402  [SL0402]  (value not drawn)
R8  SR0402  [SR0402]
R30  SR0603  [SR0603]
R39  SR0402  [SR0402]
R40  SR0402  [SR0402]
R41  SR0402  [SR0402]
RUN1  SD0805-LED  DEVICE: HSMS_C170  [SD0805-LED]
TP6  TP24-SMD  [TP24-SMD]  (value not drawn)
TP7  TP24-SMD  [TP24-SMD]  (value not drawn)
TP8  TP24-SMD  [TP24-SMD]  (value not drawn)
TP9  TP24-SMD  [TP24-SMD]  (value not drawn)
TP10  TP24-SMD  [TP24-SMD]  (value not drawn)
TP11  TP24-SMD  [TP24-SMD]  (value not drawn)
TP19  TP24-SMD  [TP24-SMD]  (value not drawn)
TP20  TP24-SMD  [TP24-SMD]  (value not drawn)
TP21  TP24-SMD  [TP24-SMD]  (value not drawn)
TP22  TP24-SMD  [TP24-SMD]  (value not drawn)
U8  DEVICE: HI3531AV100  [BGA805-32-3333]  (hidden comment: BGA805-32-3333)  (part D of 10)

### Nets
3V3: LB9.1 LB11.1 LB12.1 LB24.1 R30.1(A)
AVDD33_SATA01: C470.1(A) LB11.2 U8.AD22(AVDD33_SATA0) U8.AD23(AVDD33_SATA1)
AVDD33_SATA23: C356.1(A) LB24.2 U8.AC25(AVDD33_SATA3) U8.AD25(AVDD33_SATA2)
AVDD33_USB2: C101.1(A) C468.1(A) LB9.2 U8.J14(AVDD33_USB2)
AVDD33_USB3: C5.1(A) C467.1(A) LB12.2 U8.AG24(AVDD33_USB3)
AVDD_SATA01: C151.1(A) LB3.2 U8.AB20(AVDD_SATA0) U8.AB21(AVDD_SATA1)
AVDD_SATA23: C417.1(A) LB6.2 U8.AA22(AVDD_SATA2) U8.Y22(AVDD_SATA3)
DVDD_CORE: LB3.1 LB6.1
GND: C5.2(B) C101.2(B) C151.2(B) C356.2(B) C417.2(B) C467.2(B) C468.2(B) C470.2(B) R8.1(A) R39.1(A) R40.1(A) R41.1(A) U8.AA20(AVSS_SATA0_1) U8.AA21(AVSS_SATA2_1) U8.AB22(AVSS_SATA1_1) U8.AC26(AVSS_SATA3_2) U8.AD26(AVSS_SATA2_2) U8.AE22(AVSS_SATA0_2) U8.AE23(AVSS_SATA1_2) U8.AE29(AVSS_SATA3_3) U8.AE30(AVSS_SATA3_4) U8.AF28(AVSS_SATA3_5) U8.AF31(AVSS_SATA3_6) U8.AG25(AVSS_USB3_1) U8.AG28(AVSS_SATA2_3) U8.AG29(AVSS_SATA2_4) U8.AG30(AVSS_SATA2_5) U8.AH28(AVSS_SATA1_3) U8.AH31(AVSS_SATA2_6) U8.AJ25(AVSS_SATA0_3) U8.AJ27(AVSS_SATA0_4) U8.AJ29(AVSS_SATA1_4) U8.AJ30(AVSS_SATA2_7) U8.AK27(AVSS_SATA0_5) U8.AK29(AVSS_SATA1_5) U8.AK30(AVSS_SATA2_8) U8.AK31(AVSS_SATA2_9) U8.AL24(AVSS_USB3_2) U8.AL26(AVSS_SATA0_6) U8.AL28(AVSS_SATA1_6) U8.C11(AVSS_USB2_1) U8.D10(AVSS_USB2_2) U8.H14(AVSS_USB2_3) U8.Y21(AVSS_SATA3_1)
SATA_RXM3: C7.1(A) TP19.1
SATA_RXP3: C9.1(A) TP20.1
SATA_TXM3: C17.1(A) TP21.1
SATA_TXP3: C18.1(A) TP22.1
SYSRUN: RUN1.2(B) U8.AN31(GPIO15_0/SATA_LED_N0)
USB2_REXT: R8.2(B) R39.2(B) U8.D11(USB2_REXT)
USB3_REXT: R40.2(B) R41.2(B) U8.AH25(USB3_REXT)
NetC7_2: C7.2(B) U8.AF33(SATA_RX3M/PCIE0_RX0M)
NetC9_2: C9.2(B) U8.AF32(SATA_RX3P/PCIE0_RX0P)
NetC17_2: C17.2(B) U8.AF30(SATA_TX3M/PCIE0_TX0M)
NetC18_2: C18.2(B) U8.AF29(SATA_TX3P/PCIE0_TX0P)
NetR30_2: R30.2(B) RUN1.1(A)
NetTP6_1: TP6.1 U8.A10(GPIO14_0/USB2_OVRCUR)
NetTP7_1: TP7.1 U8.B10(GPIO14_1/USB2_PWREN)
NetTP8_1: TP8.1 U8.B11(USB2_DM)
NetTP9_1: TP9.1 U8.A11(USB2_DP)
NetTP10_1: TP10.1 U8.AN32(GPIO15_1/SATA_LED_N1)
NetTP11_1: TP11.1 U8.AM32(GPIO15_2/SATA_LED_N2)

Not connected (* = marked no-connect by the designer): U8 AH26(GPIO14_3/USB3_PWREN) AH27(GPIO14_2/USB3_OVRCUR) AH29(SATA_TX2P/PCIE1_TX0P/PCIE0_TX1P) AH30(SATA_TX2M/PCIE1_TX0M/PCIE0_TX1M) AH32(SATA_RX2P/PCIE1_RX0P/PCIE0_RX1P) AH33(SATA_RX2M/PCIE1_RX0M/PCIE0_RX1M) AJ26(SATA_TX0P/PCIE1_TX1P/USB3_TXP) AJ28(SATA_TX1P/PCIE1_TX0P) AK26(SATA_TX0M/PCIE1_TX1M/USB3_TXM) AK28(SATA_TX1M/PCIE1_TX0M) AK32(PCIE_REFCLK0P) AK33(PCIE_REFCLK0M) AL30(PCIE_REFCLK1P) AL31(PCIE_REFCLK1M) AM24(USB3_DP) AM26(SATA_RX0P/PCIE1_RX1P/USB3_RXP) AM28(SATA_RX1P/PCIE1_RX0P) AM33(GPIO15_3/SATA_LED_N3) AN24(USB3_DM) AN26(SATA_RX0M/PCIE1_RX1M/USB3_RXM) AN28(SATA_RX1M/PCIE1_RX0M)

### Notes on the sheet
- Unit 3 of Hi3531AV100 (SATA&PCIE&USB)
- (near LB3) 1000R_1.25R_0.25A_0402
- (near LB12) 1000R_1.25R_0.25A_0402
- 1%
- (near LB6) 1000R_1.25R_0.25A_0402
- (near LB9) 1000R_1.25R_0.25A_0402
- (near LB11) 1000R_1.25R_0.25A_0402
- (near LB24) 1000R_1.25R_0.25A_0402
- (in symbol GOSPELL) Title:; Rev:; Copyright:; Circuit:; Engineer:; Size:; Date:; Modify Date:; Sheet#:; out of:
- (in symbol HI3531AV100_M2_17, part D) MISC1 Interface 3 of 10

### Library data of the parts
C5 C7 C9 C17 C18 C101 = C_0_Dup2: as C199 on sheet P17 Hi3531AV100 (AD); PKG_TYPE: SC0402
C151 C467 C468 C470 = C_0_Dup2: as C430 on sheet P17 Hi3531AV100 (AD); PKG_TYPE: SC0402
C356 C417 = C_0_Dup2: as C424 on sheet P15 Hi3531AV100(VO&I2S3; PKG_TYPE: SC0402
LB3 LB11 LB12 = LB_0: as LB5 on sheet P15 Hi3531AV100(VO&I2S3; PKG_TYPE: SL0402
LB6 LB9 LB24 = LB_0: as LB4 on sheet P15 Hi3531AV100(VO&I2S3; PKG_TYPE: SL0402
R8 R40 R41 = R_1: PARTS: 1; LEVEL: STD; DEVICE: RC0402FR_07270RL; PINSWAP: (A,B); OriginalSymbolOrigin: (10,20); CODE: 7092035; %195%%232%%202%%246%: 片式厚膜电阻器-0.0625W-270OHM-+/-1%-1.0*0.5*0.35 MM; %182%%238%%182%%168%%185%%166%%194%%202%(W): 0.06; %215%%232%%214%%181%%212%%202%%208%%237%%198%%171%%178%%238%: +/-1%; COMPONENT_HIGH_MAX: 0.4MM; %208%%161%%192%%224%%195%%251%%179%%198%: 片式厚膜电阻器; PKG_TYPE: SR0402
R30 = R_1: PARTS: 1; LEVEL: STD; DEVICE: RC0603FR_07499R; PINSWAP: (A,B); OriginalSymbolOrigin: (10,20); CODE: 7090676; %195%%232%%202%%246%: 片式厚膜电阻器-0.1W-499OHM-+/-1%-0603; %182%%238%%182%%168%%185%%166%%194%%202%(W): 0.1; %215%%232%%214%%181%%212%%202%%208%%237%%198%%171%%178%%238%: +/-1%; COMPONENT_HIGH_MAX: 0.55MM; %208%%161%%192%%224%%195%%251%%179%%198%: 片式厚膜电阻器; PKG_TYPE: SR0603
R39 = R_1: PARTS: 1; LEVEL: STD; DEVICE: RC0402FR_07270RL; PINSWAP: (A,B); OriginalSymbolOrigin: (10,20); %208%%161%%192%%224%%195%%251%%179%%198%: 片式厚膜电阻器; COMPONENT_HIGH_MAX: 0.4MM; %215%%232%%214%%181%%212%%202%%208%%237%%198%%171%%178%%238%: +/-1%; %182%%238%%182%%168%%185%%166%%194%%202%(W): 0.06; %195%%232%%202%%246%: 片式厚膜电阻器-0.0625W-270OHM-+/-1%-1.0*0.5*0.35 MM; CODE: 7092035; PKG_TYPE: SR0402
RUN1 = LED_1: PARTS: 1; LEVEL: STD; CODE: 15020062; OriginalSymbolOrigin: (10,20); %208%%161%%192%%224%%195%%251%%179%%198%: 发光二极管; COMPONENT_HIGH_MAX: 1.1MM; %195%%232%%202%%246%: 发光二极管-0.015CD-红色/630NM-15MA-0805; PKG_TYPE: SD0805-LED
TP6-TP11 TP19-TP22 = TESTPOINT_0: as TP15 on sheet P17 Hi3531AV100 (AD); PKG_TYPE: TP24-SMD
U8 = HI3531AV100_M2_17: FORWARD_PCB: 1; HETERO: (HI3531AV100_DDR1),(HI3531AV100_DDR2),(HI3531AV100_SYSTEM),(HI3531AV100_AD),(HI3531AV100_VO),(HI3531AV100_M1),(HI3531AV100_M2),(HI3531AV100_POWER),(HI3531AV100_VSS1),(HI3531AV100_VSS2); LEVEL: STD; OriginalSymbolOrigin: (30,630); CODE: 35020607; CaptureCellPackProp: HI3531AV100_M2D; PARTS: 1; PKG_TYPE: BGA805-32-3333

## Sheet P13 Configuration.SchDoc
size 420 x 297 mm
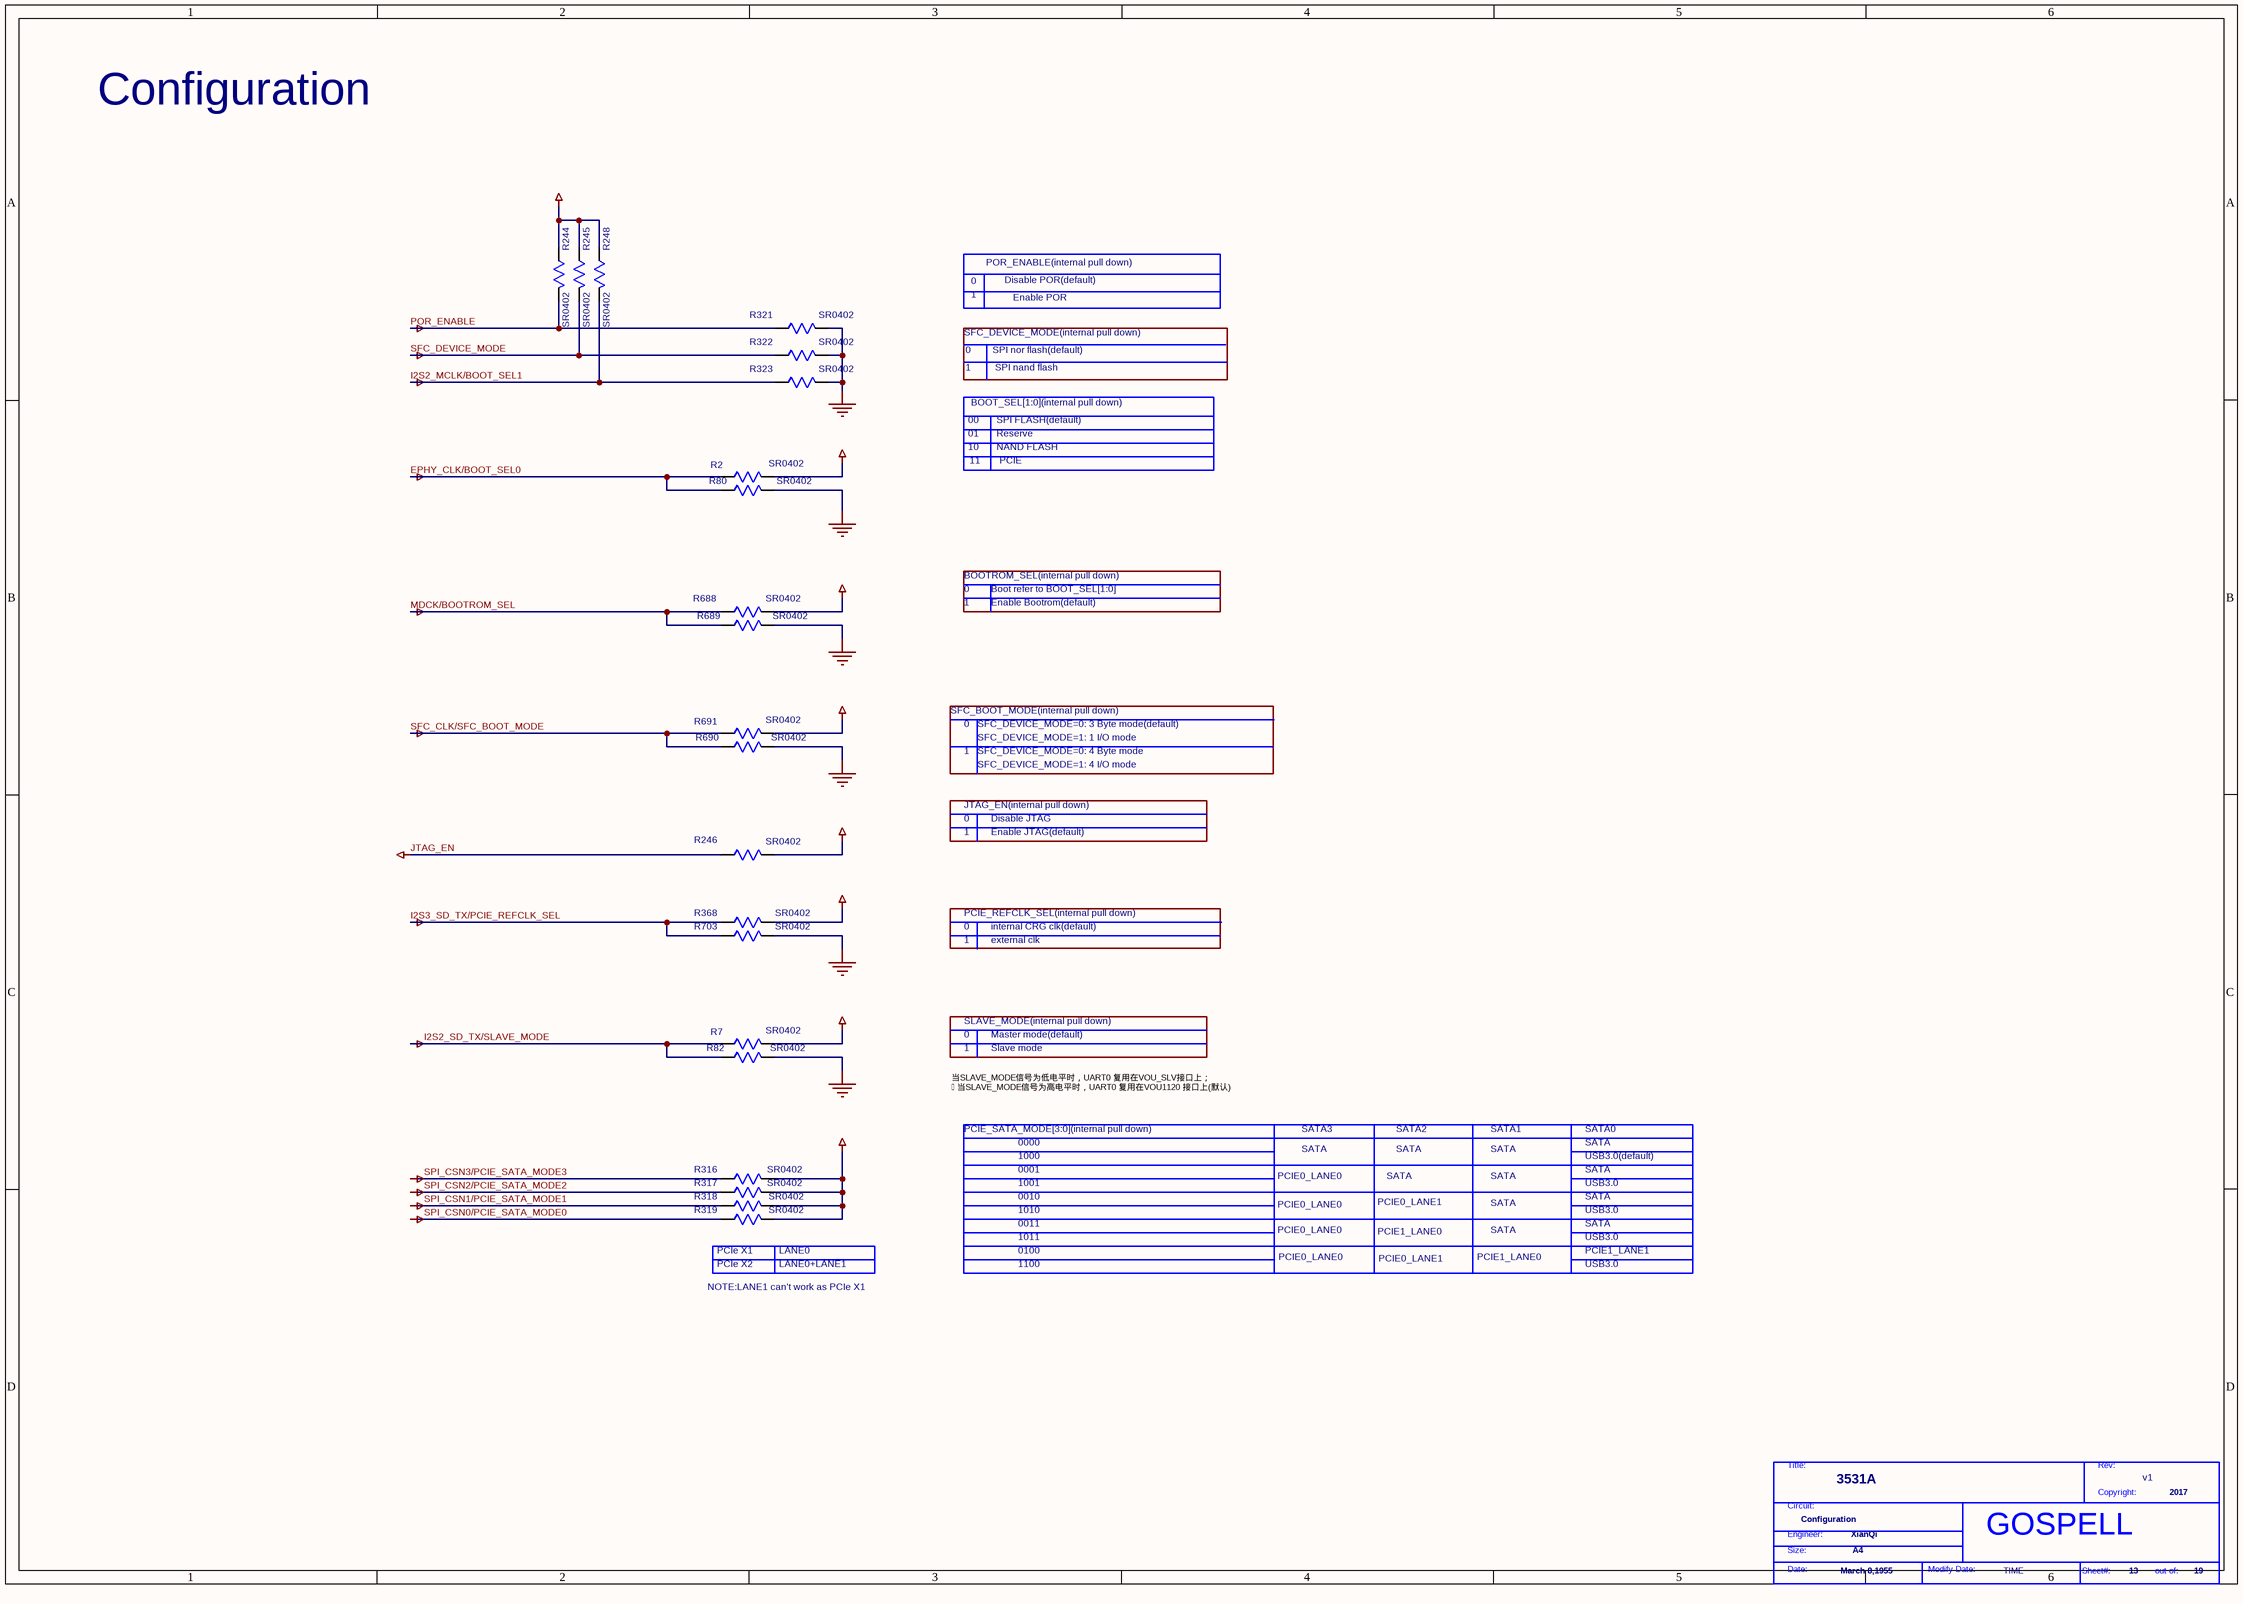
[diagram p5: P13 Configuration.SchDoc]

### Parts
(Parts that share a designator on the sheet are numbered #1, #2 ... from top to bottom, then left to right.)
*#6  Page Modify Date: TIME  Engineer: XianQi  Copyright: 2017  Title: 3531A  RevCode: v1  Page Size: A4  Page Create Date: March 8,1955  Page Number: 13  Page Count: 19  Doc: Configuration  (hidden comment: GOSPELL)  (graphical)
R2  SR0402  [SR0402]
R7  SR0402  [SR0402]
R80  SR0402  [SR0402]
R82  SR0402  [SR0402]
R244  SR0402  [SR0402]
R245  SR0402  [SR0402]
R246  SR0402  [SR0402]
R248  SR0402  [SR0402]
R316  SR0402  [SR0402]
R317  SR0402  [SR0402]
R318  SR0402  [SR0402]
R319  SR0402  [SR0402]
R321  SR0402  [SR0402]
R322  SR0402  [SR0402]
R323  SR0402  [SR0402]
R368  SR0402  [SR0402]
R688  SR0402  [SR0402]
R689  SR0402  [SR0402]
R690  SR0402  [SR0402]
R691  SR0402  [SR0402]
R703  SR0402  [SR0402]

### Nets
3V3: R2.2(B) R7.2(B) R244.1(A) R245.1(A) R246.2(B) R248.1(A) R316.2(B) R317.2(B) R318.2(B) R319.2(B) R368.2(B) R688.2(B) R691.2(B)
EPHY_CLK/BOOT_SEL0: R2.1(A) R80.1(A)
GND: R80.2(B) R82.2(B) R321.2(B) R322.2(B) R323.2(B) R689.2(B) R690.2(B) R703.2(B)
I2S2_MCLK/BOOT_SEL1: R248.2(B) R323.1(A)
I2S2_SD_TX/SLAVE_MODE: R7.1(A) R82.1(A)
I2S3_SD_TX/PCIE_REFCLK_SEL: R368.1(A) R703.1(A)
JTAG_EN: R246.1(A)
MDCK/BOOTROM_SEL: R688.1(A) R689.1(A)
POR_ENABLE: R244.2(B) R321.1(A)
SFC_CLK/SFC_BOOT_MODE: R690.1(A) R691.1(A)
SFC_DEVICE_MODE: R245.2(B) R322.1(A)
SPI_CSN0/PCIE_SATA_MODE0: R319.1(A)
SPI_CSN1/PCIE_SATA_MODE1: R318.1(A)
SPI_CSN2/PCIE_SATA_MODE2: R317.1(A)
SPI_CSN3/PCIE_SATA_MODE3: R316.1(A)

### Notes on the sheet
- Configuration
- 0
- 1
- POR_ENABLE(internal pull down)
- Disable POR(default)
- Enable POR
- SFC_DEVICE_MODE(internal pull down)
- SPI nor flash(default)
- SPI nand flash
- 10
- 01
- 00
- 11
- BOOT_SEL[1:0](internal pull down)
- NAND FLASH
- SPI FLASH(default)
- Reserve
- PCIE
- BOOTROM_SEL(internal pull down)
- Boot refer to BOOT_SEL[1:0]
- Enable Bootrom(default)
- SFC_BOOT_MODE(internal pull down)
- SFC_DEVICE_MODE=0: 3 Byte mode(default)
- SFC_DEVICE_MODE=1: 4 I/O mode
- SFC_DEVICE_MODE=0: 4 Byte mode
- SFC_DEVICE_MODE=1: 1 I/O mode
- JTAG_EN(internal pull down)
- Enable JTAG(default)
- Disable JTAG
- PCIE_REFCLK_SEL(internal pull down)
- internal CRG clk(default)
- external clk
- SLAVE_MODE(internal pull down)
- Slave mode
- Master mode(default)
- 当SLAVE_MODE信号为低电平时，UART0 复用在VOU_SLV接口上；
   当SLAVE_MODE信号为高电平时，UART0 复用在VOU1120 接口上(默认)
- PCIE_SATA_MODE[3:0](internal pull down)
- SATA3
- SATA2
- SATA1
- SATA0
- 1001
- 0001
- 0010
- 1000
- 0000
- PCIE0_LANE0
- SATA
- PCIE0_LANE1
- USB3.0(default)
- USB3.0
- PCIe X1
- PCIe X2
- LANE0+LANE1
- LANE0
- 1010
- 0011
- 1011
- 0100
- 1100
- PCIE1_LANE0
- PCIE1_LANE1
- NOTE:LANE1 can't work as PCIe X1
- (in symbol GOSPELL) Title:; Rev:; Copyright:; Circuit:; Engineer:; Size:; Date:; Modify Date:; Sheet#:; out of:

### Library data of the parts
R2 R80 R82 R246 R318 R319 R368 R689 R703 = R_1: PARTS: 1; LEVEL: STD; DEVICE: RK73B1ELTP472J; PINSWAP: (A,B); OriginalSymbolOrigin: (10,20); CODE: 7090793; %195%%232%%202%%246%: 片式厚膜电阻器-0.0625W-4700OHM-+/-5%-0402-BT; %182%%238%%182%%168%%185%%166%%194%%202%(W): 0.06; %215%%232%%214%%181%%212%%202%%208%%237%%198%%171%%178%%238%: +/-5%; COMPONENT_HIGH_MAX: 0.4MM; %208%%161%%192%%224%%195%%251%%179%%198%: 片式厚膜电阻器; PKG_TYPE: SR0402
R7 R316 R317 R688 R690 R691 = R_1: as R55 on sheet P18 CONNECT DDR1; PKG_TYPE: SR0402
R244 R248 = R_1: PARTS: 1; LEVEL: STD; DEVICE: RK73H1ETTP1002F; PINSWAP: (A,B); OriginalSymbolOrigin: (10,20); CODE: 7090867; %195%%232%%202%%246%: 片式厚膜电阻器-0.0625W-10000OHM-+/-1%-0402-BT; %182%%238%%182%%168%%185%%166%%194%%202%(W): 0.06; %215%%232%%214%%181%%212%%202%%208%%237%%198%%171%%178%%238%: +/-1%; COMPONENT_HIGH_MAX: 0.4MM; %208%%161%%192%%224%%195%%251%%179%%198%: 片式厚膜电阻器; PKG_TYPE: SR0402
R245 = R_1: PARTS: 1; LEVEL: STD; DEVICE: RK73H1ETTP1002F; PINSWAP: (A,B); OriginalSymbolOrigin: (10,20); %208%%161%%192%%224%%195%%251%%179%%198%: 片式厚膜电阻器; COMPONENT_HIGH_MAX: 0.4MM; %215%%232%%214%%181%%212%%202%%208%%237%%198%%171%%178%%238%: +/-1%; %182%%238%%182%%168%%185%%166%%194%%202%(W): 0.06; %195%%232%%202%%246%: 片式厚膜电阻器-0.0625W-10000OHM-+/-1%-0402-BT; CODE: 7090867; PKG_TYPE: SR0402
R321 R323 = R_1: as R222 on sheet P17 Hi3531AV100 (AD); PKG_TYPE: SR0402
R322 = R_1: as R221 on sheet P17 Hi3531AV100 (AD); PKG_TYPE: SR0402

## Sheet P12 SPI&NAND FLASH.SchDoc
size 297 x 209 mm
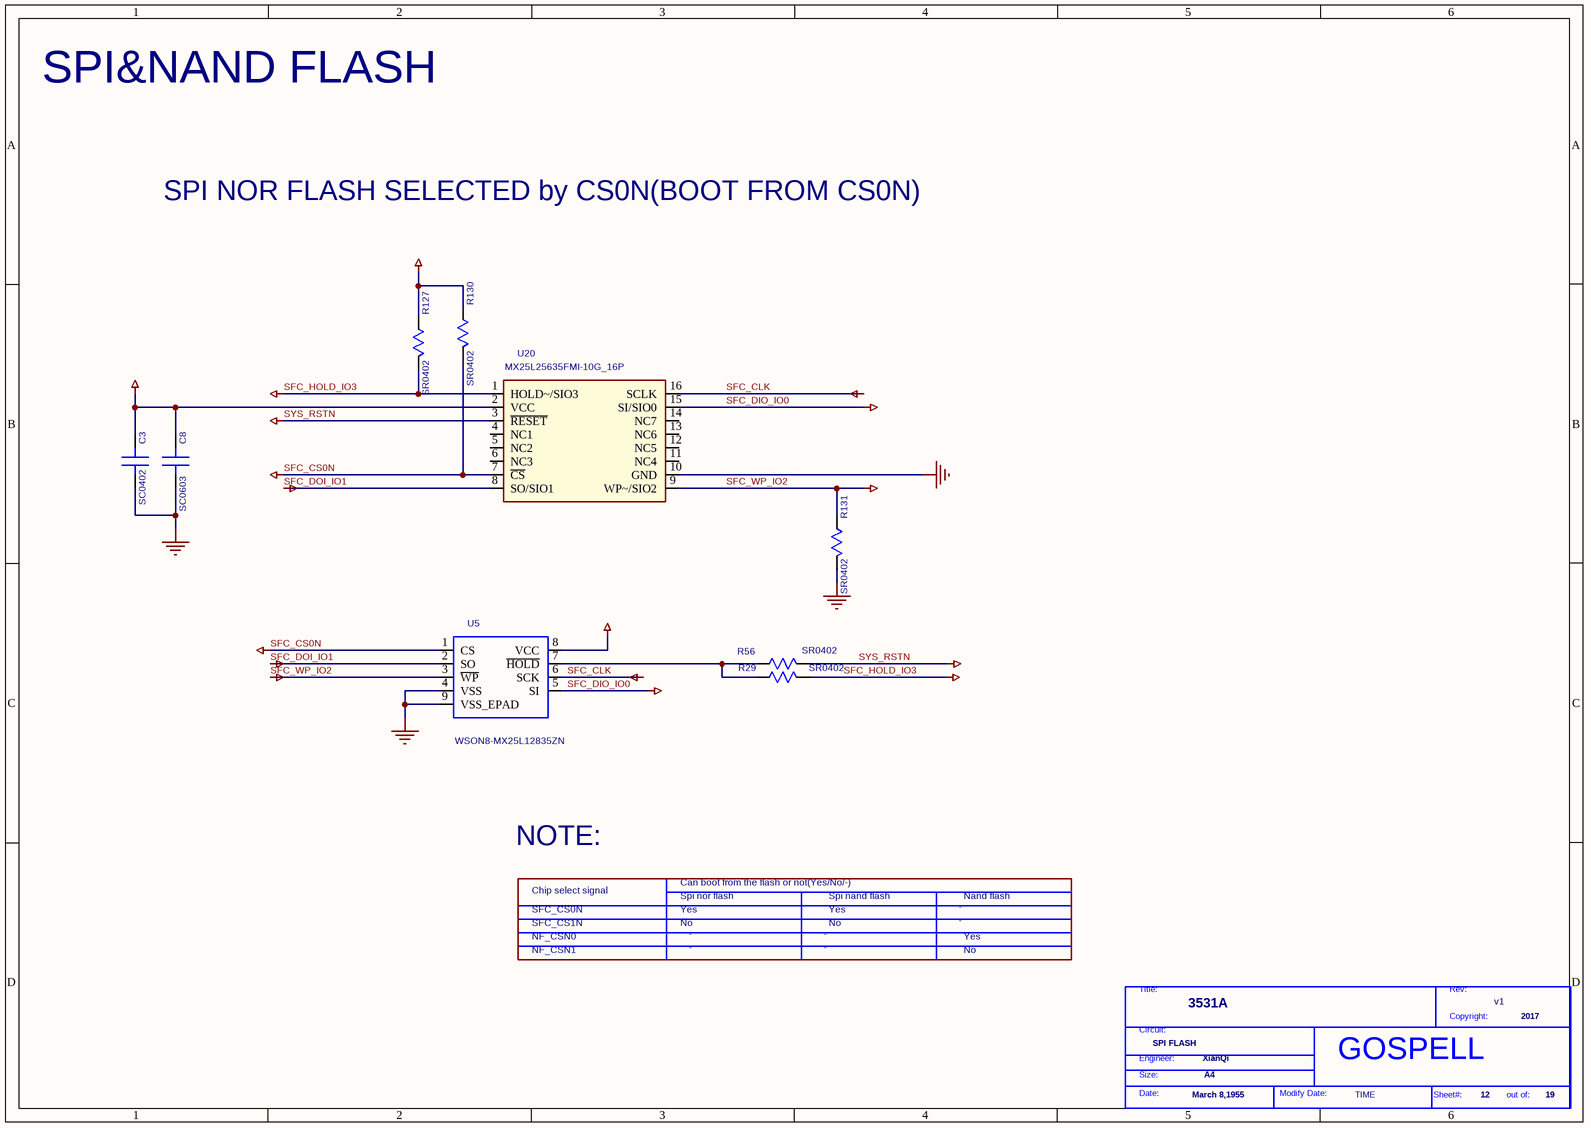
[diagram p6: P12 SPI&NAND FLASH.SchDoc]

### Parts
(Parts that share a designator on the sheet are numbered #1, #2 ... from top to bottom, then left to right.)
*#7  Page Modify Date: TIME  Engineer: XianQi  Copyright: 2017  Title: 3531A  RevCode: v1  Page Size: A4  Page Create Date: March 8,1955  Page Number: 12  Page Count: 19  Doc: SPI FLASH  (hidden comment: GOSPELL)  (graphical)
C3  SC0402  [SC0402]
C8  SC0603  [SC0603]
R29  SR0402  [SR0402]
R56  SR0402  [SR0402]
R127  SR0402  [SR0402]
R130  SR0402  [SR0402]
R131  SR0402  [SR0402]
U5  WSON8-MX25L12835ZN  [WSON8-MX25L12835ZN]
U20  DEVICE: MX25L25635FMI-10G_16P  [SOP16-50-300A]  (hidden comment: SOP16-50-300A)

### Nets
3V3: C3.1(A) C8.1(A) R127.1(A) R130.1(A) U5.8(VCC) U20.2(VCC)
GND: C3.2(B) C8.2(B) R131.2(B) U5.4(VSS) U5.9(VSS_EPAD) U20.10(GND)
SFC_CLK: U5.6(SCK) U20.16(SCLK)
SFC_CS0N: R130.2(B) U5.1(CS) U20.7(~{CS})
SFC_DIO_IO0: U5.5(SI) U20.15(SI/SIO0)
SFC_DOI_IO1: U5.2(SO) U20.8(SO/SIO1)
SFC_HOLD_IO3: R29.2(B) R127.2(B) U20.1(HOLD~/SIO3)
SFC_WP_IO2: R131.1(A) U5.3(~{WP}) U20.9(WP~/SIO2)
SYS_RSTN: R56.2(B) U20.3(~{RESET})
NetR29_1: R29.1(A) R56.1(A) U5.7(~{HOLD})

Not connected (* = marked no-connect by the designer): U20 4(NC1) 5(NC2) 6(NC3) 11(NC4) 12(NC5) 13(NC6) 14(NC7)

### Notes on the sheet
- SPI&NAND FLASH
- SPI NOR FLASH SELECTED by CS0N(BOOT FROM CS0N)
- NOTE:
- SFC_CS0N
- Chip select signal
- NF_CSN0
- SFC_CS1N
- Can boot from the flash or not(Yes/No/-)
- Spi nor flash
- No
- Yes
- -
- Spi nand flash
- Nand flash
- NF_CSN1
- (in symbol GOSPELL) Title:; Rev:; Copyright:; Circuit:; Engineer:; Size:; Date:; Modify Date:; Sheet#:; out of:

### Library data of the parts
C3 = C_0_Dup2: as C198 on sheet P16 Hi3531AV100(RGMII&I; PKG_TYPE: SC0402
C8 = C_0_Dup1: PARTS: 1; OriginalSymbolOrigin: (0,30); DEVICE: C1608X5R0J106MT0A0E; LEVEL: STD; PINSWAP: (A,B); %208%%161%%192%%224%%195%%251%%179%%198%: SMD陶瓷电容; COMPONENT_HIGH_MAX: 0.9MM; %182%%238%%182%%168%%185%%164%%215%%247%%181%%231%%209%%185%(V): 6.3; %195%%232%%202%%246%: SMD陶瓷电容-6.3V-10000NF-+/-20%-X5R-0603-BT,TS16949; CODE: 8070649; PKG_TYPE: SC0603
R29 = R_1: PARTS: 1; LEVEL: STD; DEVICE: RC0402JR_070R; PINSWAP: (A,B); OriginalSymbolOrigin: (10,20); CODE: 7090800; %195%%232%%202%%246%: 片式厚膜电阻器-0.0625W-0OHM-< 50MOHM-0402-1A-BT; %182%%238%%182%%168%%185%%166%%194%%202%(W): 0.06; %215%%232%%214%%181%%212%%202%%208%%237%%198%%171%%178%%238%: < 50MOHM; COMPONENT_HIGH_MAX: 0.4MM; %208%%161%%192%%224%%195%%251%%179%%198%: 片式厚膜电阻器; PKG_TYPE: SR0402
R56 = R_1: PARTS: 1; LEVEL: STD; DEVICE: RC0402JR_070R; PINSWAP: (A,B); OriginalSymbolOrigin: (10,20); %208%%161%%192%%224%%195%%251%%179%%198%: 片式厚膜电阻器; COMPONENT_HIGH_MAX: 0.4MM; %215%%232%%214%%181%%212%%202%%208%%237%%198%%171%%178%%238%: < 50MOHM; %182%%238%%182%%168%%185%%166%%194%%202%(W): 0.06; %195%%232%%202%%246%: 片式厚膜电阻器-0.0625W-0OHM-< 50MOHM-0402-1A-BT; CODE: 7090800; PKG_TYPE: SR0402
R127 R130 R131 = R_1: as R55 on sheet P18 CONNECT DDR1; PKG_TYPE: SR0402
U5 = SPI_NAND_FLASH_0: PARTS: 1; DEVICE: 8PIN_SPI_FLASH; LEVEL: STD; OriginalSymbolOrigin: (20,70); %195%%232%%202%%246%: SPI NAND FLASH-2GBIT-GD5F2GQ4UAYIG; CODE: 36DM0U9A; PKG_TYPE: WSON8-MX25L12835ZN
U20 = MX25L25635EMI-12G_1: PARTS: 1; LEVEL: STD; OriginalSymbolOrigin: (10,100); CODE: HBVT3001; %195%%232%%202%%246%: SPI FLASH-256MBIT-50MHZ-64KB-3.3V-SOP16L-00425847; COMPONENT_HIGH_MAX: 2.65MM; PKG_TYPE: SOP16-50-300A